# EAGLE design Acoustics (EAGLE 9.1.3)

## Sheet 1 of 5: Connectors
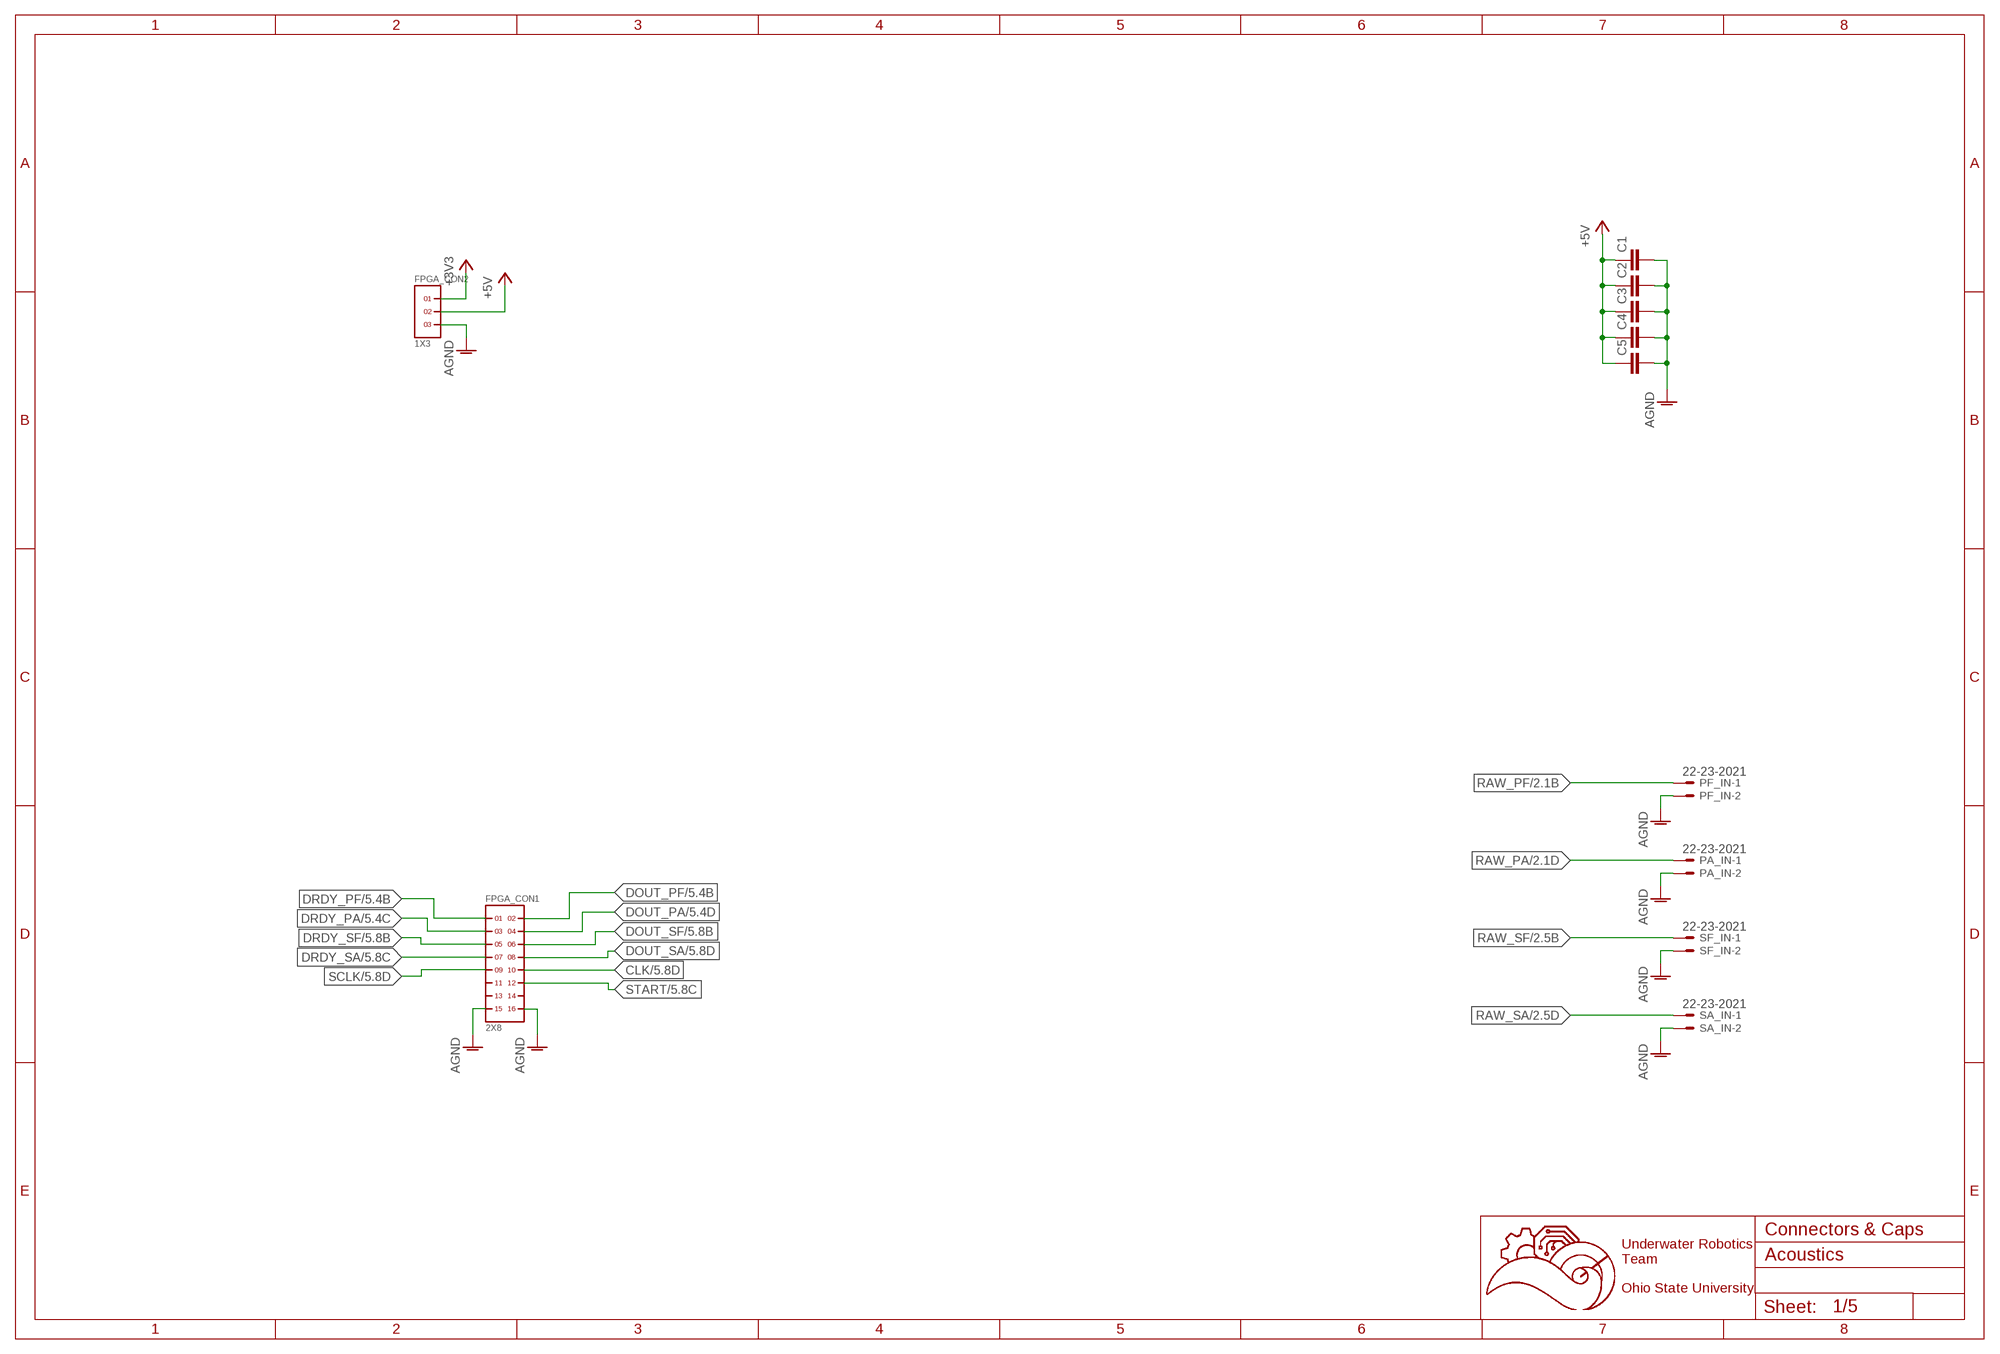
[diagram p0: schematic, sheet 1]

### Parts
C1  C2,5-3  [C2.5-3]
C2  C2,5-3  [C2.5-3]
C3  C2,5-3  [C2.5-3]
C4  C2,5-3  [C2.5-3]
C5  C2,5-3  [C2.5-3]
FPGA_CON1  2X8  [2X8]
FPGA_CON2  1X3  [1X3]
PA_IN  22-23-2021  [22-23-2021]
PF_IN  22-23-2021  [22-23-2021]
SA_IN  22-23-2021  [22-23-2021]
SF_IN  22-23-2021  [22-23-2021]

### Nets
+3V3: FPGA_CON2.1 ; also sheet 2,3,4,5
+5V: C1.1 C2.1 C3.1 C4.1 C5.1 FPGA_CON2.2
CLK: FPGA_CON1.10 ; also sheet 5
DOUT_PA: FPGA_CON1.4 ; also sheet 5
DOUT_PF: FPGA_CON1.2 ; also sheet 5
DOUT_SA: FPGA_CON1.8 ; also sheet 5
DOUT_SF: FPGA_CON1.6 ; also sheet 5
DRDY_PA: FPGA_CON1.3 ; also sheet 5
DRDY_PF: FPGA_CON1.1 ; also sheet 5
DRDY_SA: FPGA_CON1.7 ; also sheet 5
DRDY_SF: FPGA_CON1.5 ; also sheet 5
GND: C1.2 C2.2 C3.2 C4.2 C5.2 FPGA_CON1.15 FPGA_CON1.16 FPGA_CON2.3 PA_IN.2 PF_IN.2 SA_IN.2 SF_IN.2 ; supply symbol labelled AGND ; also sheet 2,3,4,5
RAW_PA: PA_IN.1 ; also sheet 2
RAW_PF: PF_IN.1 ; also sheet 2
RAW_SA: SA_IN.1 ; also sheet 2
RAW_SF: SF_IN.1 ; also sheet 2
SCLK: FPGA_CON1.9 ; also sheet 5
START: FPGA_CON1.12 ; also sheet 5
Unconnected: FPGA_CON1.11 FPGA_CON1.13 FPGA_CON1.14

### Notes on the sheet
- Connectors & Caps
- Underwater Robotics
  Team
  
  Ohio State University

## Sheet 2 of 5: Pre-amp
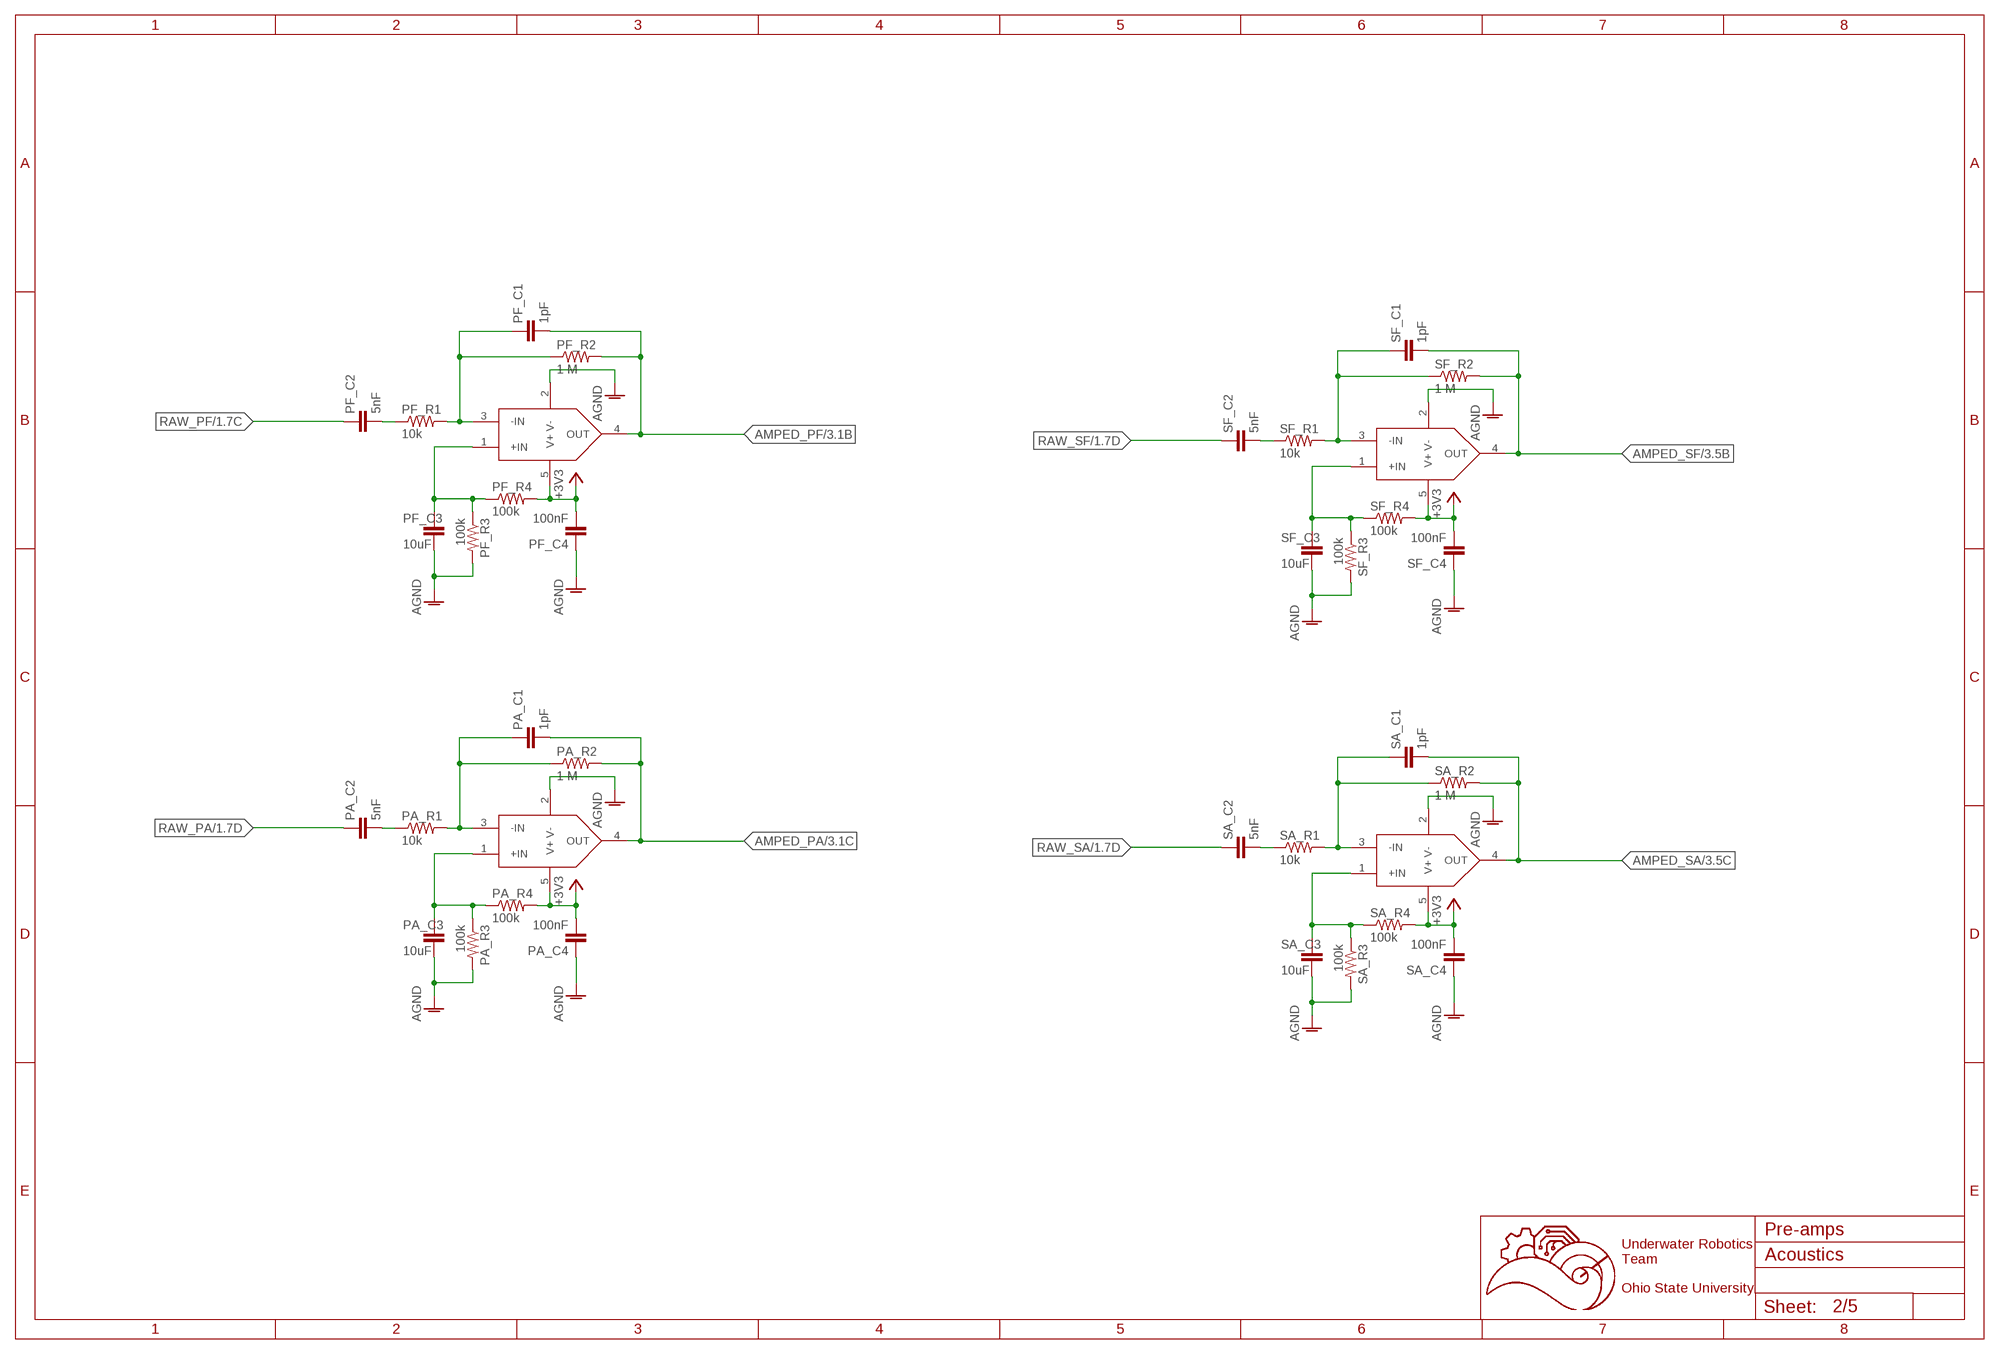
[diagram p1: schematic, sheet 2]

### Parts
H4_PREAMP4  TLV6741  [SC70-5]
PA_C1  1pF  C-EUC0603  [C0603]
PA_C2  5nF  C-EUC0603  [C0603]
PA_C3  10uF  C-EUC0603  [C0603]
PA_C4  100nF  C-EUC0603  [C0603]
PA_PREAMP  TLV6741  [SC70-5]
PA_R1  10k  R-US_R0603  [R0603]
PA_R2  1 M  R-US_R0603  [R0603]
PA_R3  100k  R-US_R0603  [R0603]
PA_R4  100k  R-US_R0603  [R0603]
PF_C1  1pF  C-EUC0603  [C0603]
PF_C2  5nF  C-EUC0603  [C0603]
PF_C3  10uF  C-EUC0603  [C0603]
PF_C4  100nF  C-EUC0603  [C0603]
PF_PREAMP  TLV6741  [SC70-5]
PF_R1  10k  R-US_R0603  [R0603]
PF_R2  1 M  R-US_R0603  [R0603]
PF_R3  100k  R-US_R0603  [R0603]
PF_R4  100k  R-US_R0603  [R0603]
SA_C1  1pF  C-EUC0603  [C0603]
SA_C2  5nF  C-EUC0603  [C0603]
SA_C3  10uF  C-EUC0603  [C0603]
SA_C4  100nF  C-EUC0603  [C0603]
SA_R1  10k  R-US_R0603  [R0603]
SA_R2  1 M  R-US_R0603  [R0603]
SA_R3  100k  R-US_R0603  [R0603]
SA_R4  100k  R-US_R0603  [R0603]
SF_C1  1pF  C-EUC0603  [C0603]
SF_C2  5nF  C-EUC0603  [C0603]
SF_C3  10uF  C-EUC0603  [C0603]
SF_C4  100nF  C-EUC0603  [C0603]
SF_PREAMP3  TLV6741  [SC70-5]
SF_R1  10k  R-US_R0603  [R0603]
SF_R2  1 M  R-US_R0603  [R0603]
SF_R3  100k  R-US_R0603  [R0603]
SF_R4  100k  R-US_R0603  [R0603]

### Nets
+3V3: H4_PREAMP4.5(V+) PA_C4.2 PA_PREAMP.5(V+) PA_R4.2 PF_C4.2 PF_PREAMP.5(V+) PF_R4.2 SA_C4.2 SA_R4.2 SF_C4.2 SF_PREAMP3.5(V+) SF_R4.2 ; also sheet 1,3,4,5
AMPED_PA: PA_C1.2 PA_PREAMP.4(OUT) PA_R2.2 ; also sheet 3
AMPED_PF: PF_C1.2 PF_PREAMP.4(OUT) PF_R2.2 ; also sheet 3
AMPED_SA: H4_PREAMP4.4(OUT) SA_C1.2 SA_R2.2 ; also sheet 3
AMPED_SF: SF_C1.2 SF_PREAMP3.4(OUT) SF_R2.2 ; also sheet 3
GND: H4_PREAMP4.2(V-) PA_C3.2 PA_C4.1 PA_PREAMP.2(V-) PA_R3.2 PF_C3.2 PF_C4.1 PF_PREAMP.2(V-) PF_R3.2 SA_C3.2 SA_C4.1 SA_R3.2 SF_C3.2 SF_C4.1 SF_PREAMP3.2(V-) SF_R3.2 ; supply symbol labelled AGND ; also sheet 1,3,4,5
N$133: PF_C2.2 PF_R1.1
N$134: PF_C1.1 PF_PREAMP.3(-IN) PF_R1.2 PF_R2.1
N$135: PF_C3.1 PF_PREAMP.1(+IN) PF_R3.1 PF_R4.1
N$137: PA_C2.2 PA_R1.1
N$138: PA_C1.1 PA_PREAMP.3(-IN) PA_R1.2 PA_R2.1
N$139: PA_C3.1 PA_PREAMP.1(+IN) PA_R3.1 PA_R4.1
N$141: SF_C2.2 SF_R1.1
N$142: SF_C1.1 SF_PREAMP3.3(-IN) SF_R1.2 SF_R2.1
N$143: SF_C3.1 SF_PREAMP3.1(+IN) SF_R3.1 SF_R4.1
N$145: SA_C2.2 SA_R1.1
N$146: H4_PREAMP4.3(-IN) SA_C1.1 SA_R1.2 SA_R2.1
N$147: H4_PREAMP4.1(+IN) SA_C3.1 SA_R3.1 SA_R4.1
RAW_PA: PA_C2.1 ; also sheet 1
RAW_PF: PF_C2.1 ; also sheet 1
RAW_SA: SA_C2.1 ; also sheet 1
RAW_SF: SF_C2.1 ; also sheet 1

### Notes on the sheet
- Pre-amps
- Underwater Robotics
  Team
  
  Ohio State University

## Sheet 3 of 5: Differential amplifier
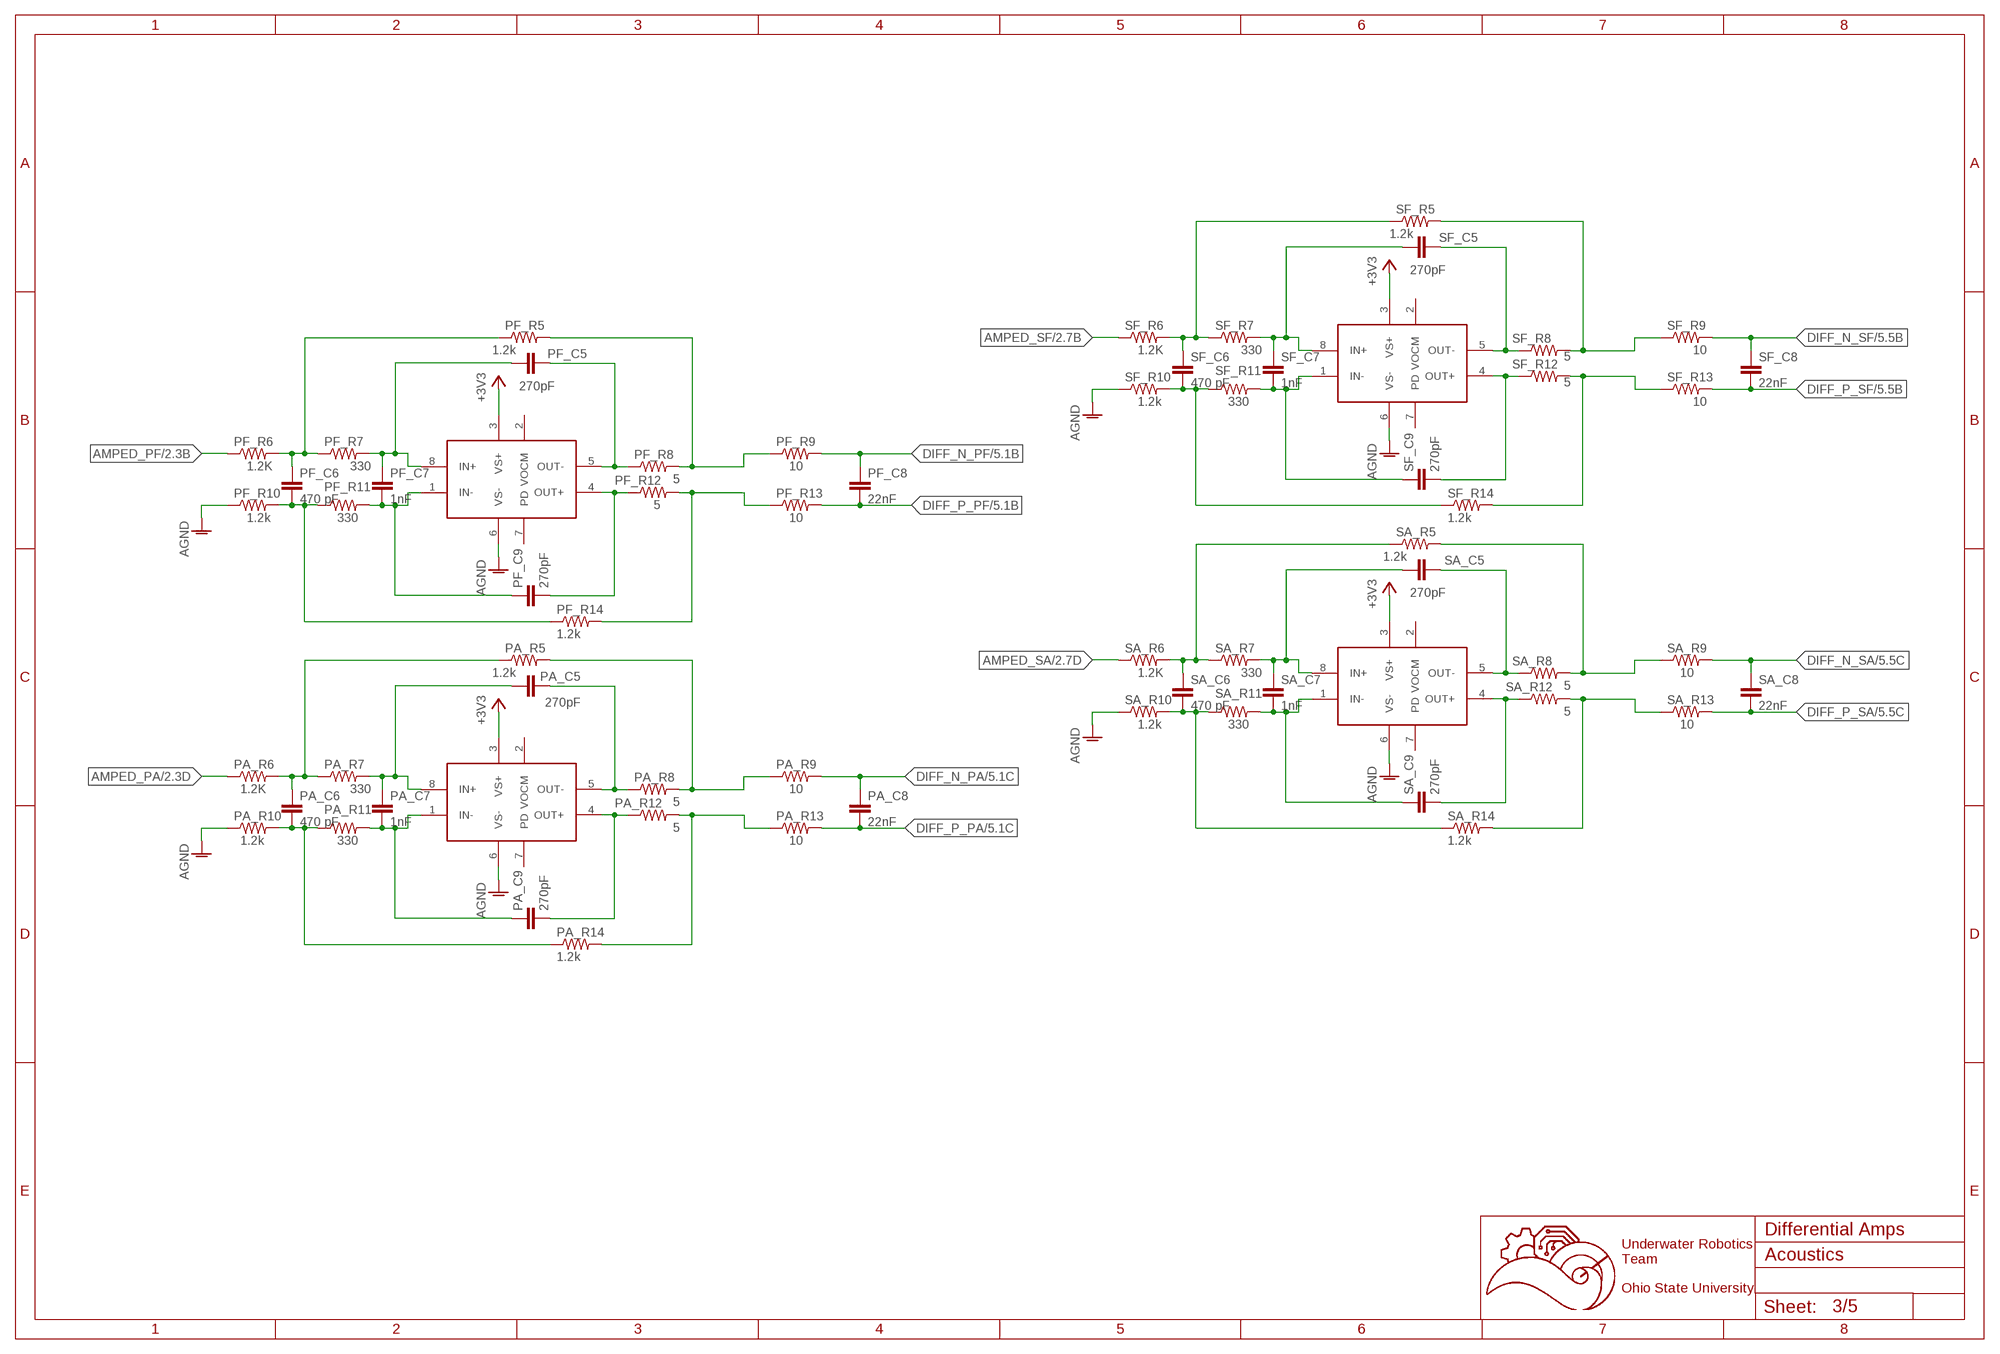
[diagram p2: schematic, sheet 3]

### Parts
PA_C5  270pF  C-EUC0603  [C0603]
PA_C6  470 pF  C-EUC0603  [C0603]
PA_C7  1nF  C-EUC0603  [C0603]
PA_C8  22nF  C-EUC0603  [C0603]
PA_C9  270pF  C-EUC0603  [C0603]
PA_DA  THS4551  [VSSOP-8]
PA_R5  1.2k  R-US_R0603  [R0603]
PA_R6  1.2K  R-US_R0603  [R0603]
PA_R7  330  R-US_R0603  [R0603]
PA_R8  5  R-US_R0603  [R0603]
PA_R9  10  R-US_R0603  [R0603]
PA_R10  1.2k  R-US_R0603  [R0603]
PA_R11  330  R-US_R0603  [R0603]
PA_R12  5  R-US_R0603  [R0603]
PA_R13  10  R-US_R0603  [R0603]
PA_R14  1.2k  R-US_R0603  [R0603]
PF_C5  270pF  C-EUC0603  [C0603]
PF_C6  470 pF  C-EUC0603  [C0603]
PF_C7  1nF  C-EUC0603  [C0603]
PF_C8  22nF  C-EUC0603  [C0603]
PF_C9  270pF  C-EUC0603  [C0603]
PF_DA  THS4551  [VSSOP-8]
PF_R5  1.2k  R-US_R0603  [R0603]
PF_R6  1.2K  R-US_R0603  [R0603]
PF_R7  330  R-US_R0603  [R0603]
PF_R8  5  R-US_R0603  [R0603]
PF_R9  10  R-US_R0603  [R0603]
PF_R10  1.2k  R-US_R0603  [R0603]
PF_R11  330  R-US_R0603  [R0603]
PF_R12  5  R-US_R0603  [R0603]
PF_R13  10  R-US_R0603  [R0603]
PF_R14  1.2k  R-US_R0603  [R0603]
SA_C5  270pF  C-EUC0603  [C0603]
SA_C6  470 pF  C-EUC0603  [C0603]
SA_C7  1nF  C-EUC0603  [C0603]
SA_C8  22nF  C-EUC0603  [C0603]
SA_C9  270pF  C-EUC0603  [C0603]
SA_DA  THS4551  [VSSOP-8]
SA_R5  1.2k  R-US_R0603  [R0603]
SA_R6  1.2K  R-US_R0603  [R0603]
SA_R7  330  R-US_R0603  [R0603]
SA_R8  5  R-US_R0603  [R0603]
SA_R9  10  R-US_R0603  [R0603]
SA_R10  1.2k  R-US_R0603  [R0603]
SA_R11  330  R-US_R0603  [R0603]
SA_R12  5  R-US_R0603  [R0603]
SA_R13  10  R-US_R0603  [R0603]
SA_R14  1.2k  R-US_R0603  [R0603]
SF_C5  270pF  C-EUC0603  [C0603]
SF_C6  470 pF  C-EUC0603  [C0603]
SF_C7  1nF  C-EUC0603  [C0603]
SF_C8  22nF  C-EUC0603  [C0603]
SF_C9  270pF  C-EUC0603  [C0603]
SF_DA  THS4551  [VSSOP-8]
SF_R5  1.2k  R-US_R0603  [R0603]
SF_R6  1.2K  R-US_R0603  [R0603]
SF_R7  330  R-US_R0603  [R0603]
SF_R8  5  R-US_R0603  [R0603]
SF_R9  10  R-US_R0603  [R0603]
SF_R10  1.2k  R-US_R0603  [R0603]
SF_R11  330  R-US_R0603  [R0603]
SF_R12  5  R-US_R0603  [R0603]
SF_R13  10  R-US_R0603  [R0603]
SF_R14  1.2k  R-US_R0603  [R0603]

### Nets
+3V3: PA_DA.3(VS+) PF_DA.3(VS+) SA_DA.3(VS+) SF_DA.3(VS+) ; also sheet 1,2,4,5
AMPED_PA: PA_R6.1 ; also sheet 2
AMPED_PF: PF_R6.1 ; also sheet 2
AMPED_SA: SA_R6.1 ; also sheet 2
AMPED_SF: SF_R6.1 ; also sheet 2
DIFF_N_PA: PA_C8.1 PA_R9.2 ; also sheet 5
DIFF_N_PF: PF_C8.1 PF_R9.2 ; also sheet 5
DIFF_N_SA: SA_C8.1 SA_R9.2 ; also sheet 5
DIFF_N_SF: SF_C8.1 SF_R9.2 ; also sheet 5
DIFF_P_PA: PA_C8.2 PA_R13.2 ; also sheet 5
DIFF_P_PF: PF_C8.2 PF_R13.2 ; also sheet 5
DIFF_P_SA: SA_C8.2 SA_R13.2 ; also sheet 5
DIFF_P_SF: SF_C8.2 SF_R13.2 ; also sheet 5
GND: PA_DA.6(VS-) PA_R10.1 PF_DA.6(VS-) PF_R10.1 SA_DA.6(VS-) SA_R10.1 SF_DA.6(VS-) SF_R10.1 ; supply symbol labelled AGND ; also sheet 1,2,4,5
N$1: PA_C5.2 PA_DA.5(OUT-) PA_R8.1
N$2: PA_C5.1 PA_C7.1 PA_DA.8(IN+) PA_R7.2
N$3: PA_C7.2 PA_C9.1 PA_DA.1(IN-) PA_R11.2
N$4: PA_C6.1 PA_R5.1 PA_R6.2 PA_R7.1
N$5: PA_C6.2 PA_R10.2 PA_R11.1 PA_R14.1
N$6: PA_C9.2 PA_DA.4(OUT+) PA_R12.1
N$7: PA_R5.2 PA_R8.2 PA_R9.1
N$8: PA_R12.2 PA_R13.1 PA_R14.2
N$9: SF_C5.2 SF_DA.5(OUT-) SF_R8.1
N$10: SF_C5.1 SF_C7.1 SF_DA.8(IN+) SF_R7.2
N$11: SF_C7.2 SF_C9.1 SF_DA.1(IN-) SF_R11.2
N$12: SF_C6.1 SF_R5.1 SF_R6.2 SF_R7.1
N$13: SF_C6.2 SF_R10.2 SF_R11.1 SF_R14.1
N$14: SF_C9.2 SF_DA.4(OUT+) SF_R12.1
N$15: SF_R5.2 SF_R8.2 SF_R9.1
N$16: SF_R12.2 SF_R13.1 SF_R14.2
N$17: SA_C5.2 SA_DA.5(OUT-) SA_R8.1
N$18: SA_C5.1 SA_C7.1 SA_DA.8(IN+) SA_R7.2
N$19: SA_C7.2 SA_C9.1 SA_DA.1(IN-) SA_R11.2
N$20: SA_C6.1 SA_R5.1 SA_R6.2 SA_R7.1
N$21: SA_C6.2 SA_R10.2 SA_R11.1 SA_R14.1
N$22: SA_C9.2 SA_DA.4(OUT+) SA_R12.1
N$23: SA_R5.2 SA_R8.2 SA_R9.1
N$24: SA_R12.2 SA_R13.1 SA_R14.2
N$88: PF_R12.2 PF_R13.1 PF_R14.2
N$97: PF_C5.2 PF_DA.5(OUT-) PF_R8.1
N$98: PF_C5.1 PF_C7.1 PF_DA.8(IN+) PF_R7.2
N$99: PF_C7.2 PF_C9.1 PF_DA.1(IN-) PF_R11.2
N$100: PF_C6.1 PF_R5.1 PF_R6.2 PF_R7.1
N$101: PF_C6.2 PF_R10.2 PF_R11.1 PF_R14.1
N$102: PF_C9.2 PF_DA.4(OUT+) PF_R12.1
N$109: PF_R5.2 PF_R8.2 PF_R9.1
Unconnected: PA_DA.2(VOCM) PA_DA.7(PD) PF_DA.2(VOCM) PF_DA.7(PD) SA_DA.2(VOCM) SA_DA.7(PD) SF_DA.2(VOCM) SF_DA.7(PD)

### Notes on the sheet
- Differential Amps
- Underwater Robotics
  Team
  
  Ohio State University

## Sheet 4 of 5: Voltage Reference
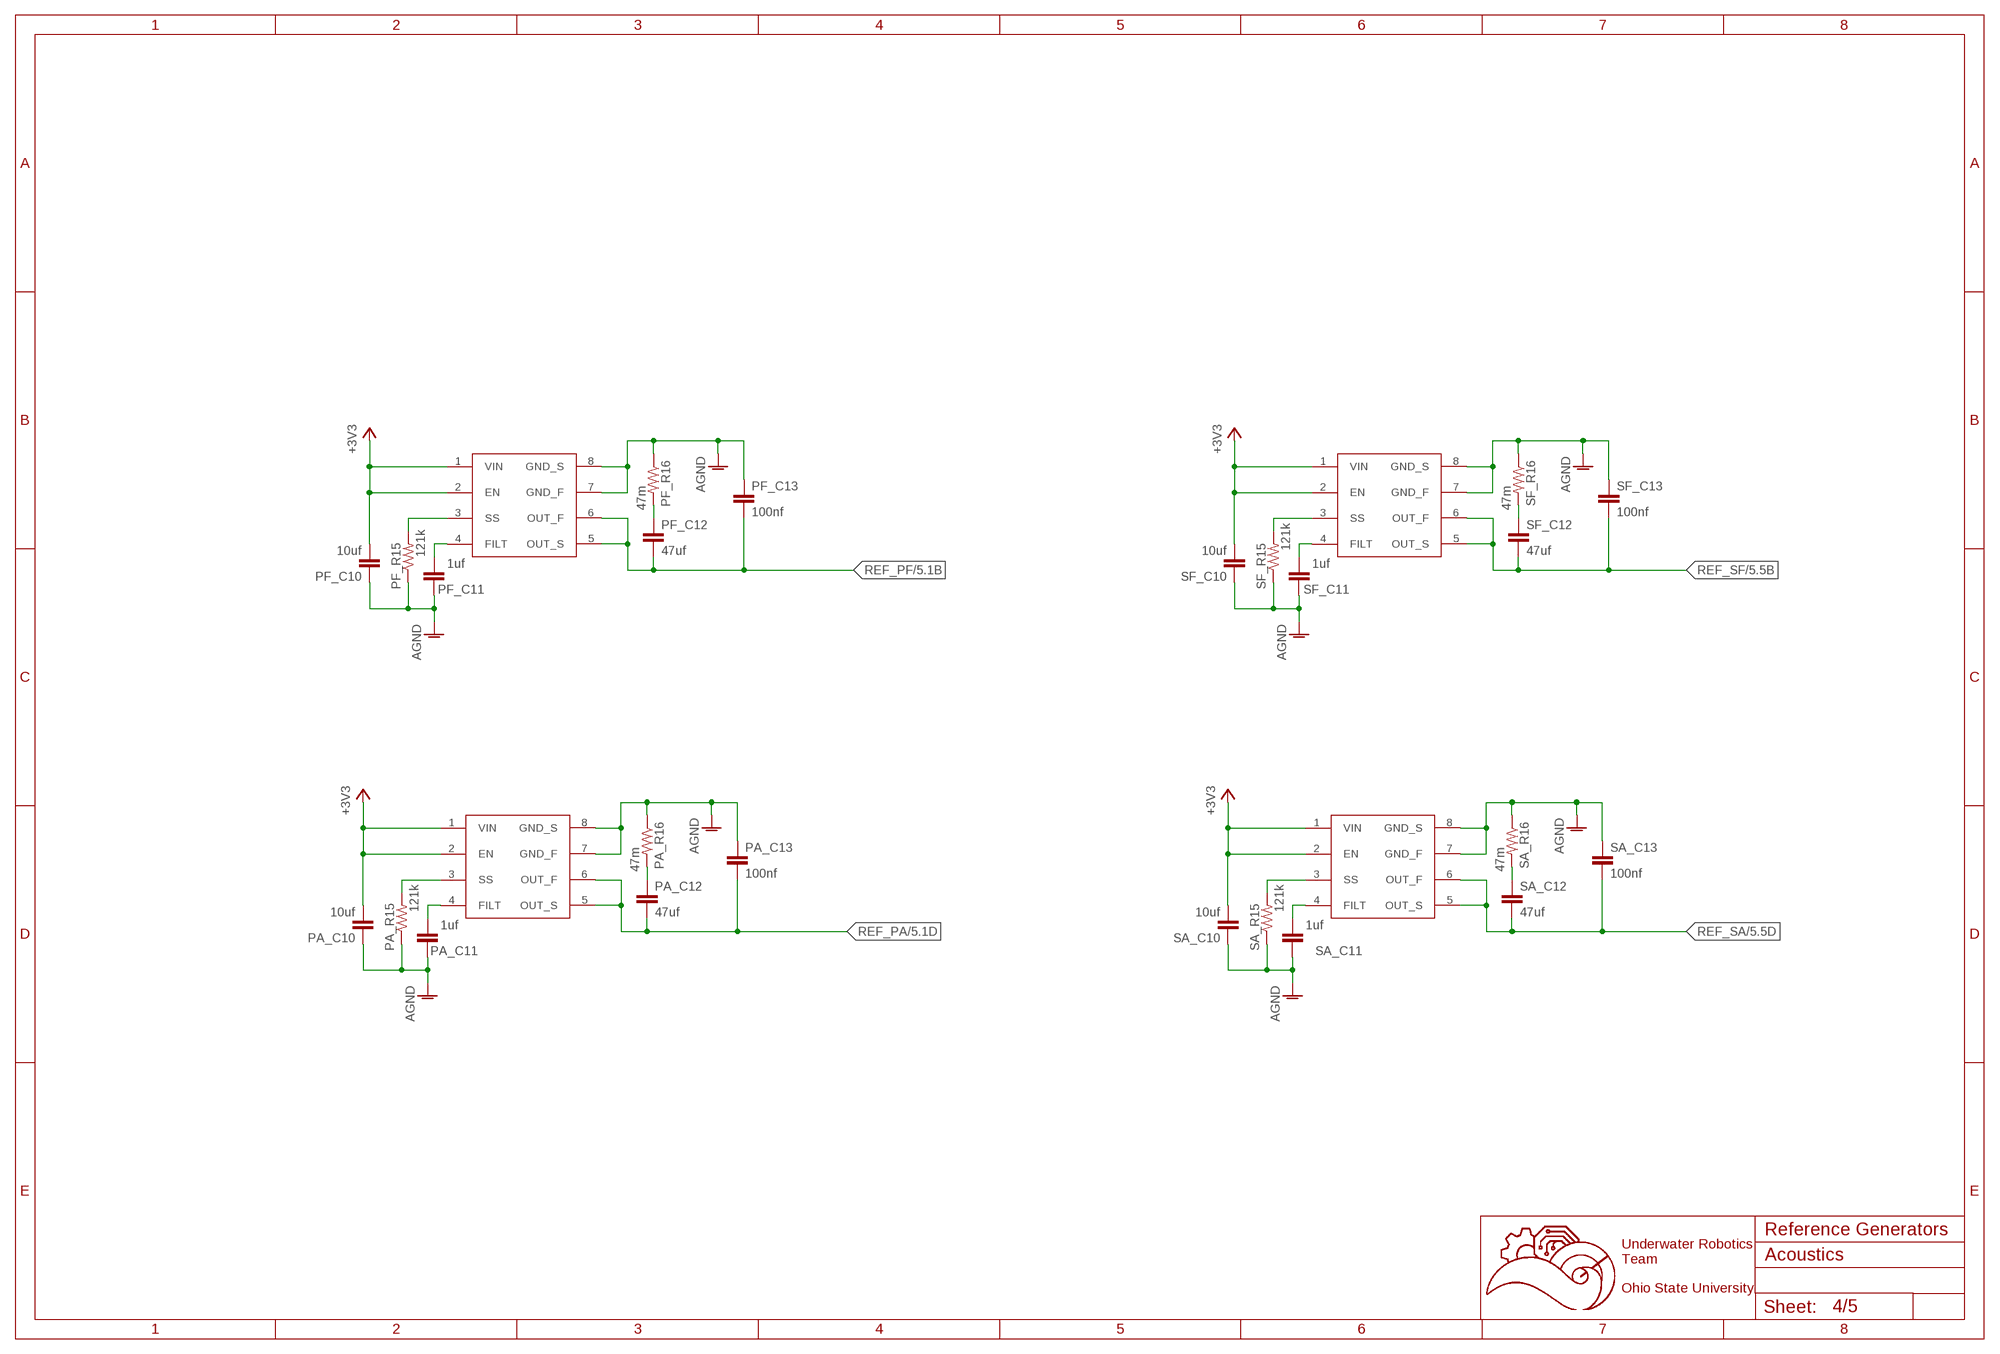
[diagram p3: schematic, sheet 4]

### Parts
PA_C10  10uf  C-EUC0603  [C0603]
PA_C11  1uf  C-EUC0603  [C0603]
PA_C12  47uf  C-EUC0603  [C0603]
PA_C13  100nf  C-EUC0603  [C0603]
PA_R15  121k  R-US_R0603  [R0603]
PA_R16  47m  R-US_R0603  [R0603]
PA_REFGEN  REF6025  [REF6025]
PF_C10  10uf  C-EUC0603  [C0603]
PF_C11  1uf  C-EUC0603  [C0603]
PF_C12  47uf  C-EUC0603  [C0603]
PF_C13  100nf  C-EUC0603  [C0603]
PF_R15  121k  R-US_R0603  [R0603]
PF_R16  47m  R-US_R0603  [R0603]
PF_REFGEN  REF6025  [REF6025]
SA_C10  10uf  C-EUC0603  [C0603]
SA_C11  1uf  C-EUC0603  [C0603]
SA_C12  47uf  C-EUC0603  [C0603]
SA_C13  100nf  C-EUC0603  [C0603]
SA_R15  121k  R-US_R0603  [R0603]
SA_R16  47m  R-US_R0603  [R0603]
SA_REFGEN  REF6025  [REF6025]
SF_C10  10uf  C-EUC0603  [C0603]
SF_C11  1uf  C-EUC0603  [C0603]
SF_C12  47uf  C-EUC0603  [C0603]
SF_C13  100nf  C-EUC0603  [C0603]
SF_R15  121k  R-US_R0603  [R0603]
SF_R16  47m  R-US_R0603  [R0603]
SF_REFGEN  REF6025  [REF6025]

### Nets
+3V3: PA_C10.2 PA_REFGEN.1(VIN) PA_REFGEN.2(EN) PF_C10.2 PF_REFGEN.1(VIN) PF_REFGEN.2(EN) SA_C10.2 SA_REFGEN.1(VIN) SA_REFGEN.2(EN) SF_C10.2 SF_REFGEN.1(VIN) SF_REFGEN.2(EN) ; also sheet 1,2,3,5
GND: PA_C10.1 PA_C11.1 PA_C13.1 PA_R15.1 PA_R16.1 PA_REFGEN.7(GND_F) PA_REFGEN.8(GND_S) PF_C10.1 PF_C11.1 PF_C13.1 PF_R15.1 PF_R16.1 PF_REFGEN.7(GND_F) PF_REFGEN.8(GND_S) SA_C10.1 SA_C11.1 SA_C13.1 SA_R15.1 SA_R16.1 SA_REFGEN.7(GND_F) SA_REFGEN.8(GND_S) SF_C10.1 SF_C11.1 SF_C13.1 SF_R15.1 SF_R16.1 SF_REFGEN.7(GND_F) SF_REFGEN.8(GND_S) ; supply symbol labelled AGND ; also sheet 1,2,3,5
N$103: PF_C11.2 PF_REFGEN.4(FILT)
N$104: PF_R15.2 PF_REFGEN.3(SS)
N$105: PF_C12.1 PF_R16.2
N$110: PA_C11.2 PA_REFGEN.4(FILT)
N$116: PA_R15.2 PA_REFGEN.3(SS)
N$117: PA_C12.1 PA_R16.2
N$118: SF_C11.2 SF_REFGEN.4(FILT)
N$121: SF_R15.2 SF_REFGEN.3(SS)
N$124: SF_C12.1 SF_R16.2
N$129: SA_C11.2 SA_REFGEN.4(FILT)
N$130: SA_R15.2 SA_REFGEN.3(SS)
N$131: SA_C12.1 SA_R16.2
REF_PA: PA_C12.2 PA_C13.2 PA_REFGEN.5(OUT_S) PA_REFGEN.6(OUT_F) ; also sheet 5
REF_PF: PF_C12.2 PF_C13.2 PF_REFGEN.5(OUT_S) PF_REFGEN.6(OUT_F) ; also sheet 5
REF_SA: SA_C12.2 SA_C13.2 SA_REFGEN.5(OUT_S) SA_REFGEN.6(OUT_F) ; also sheet 5
REF_SF: SF_C12.2 SF_C13.2 SF_REFGEN.5(OUT_S) SF_REFGEN.6(OUT_F) ; also sheet 5

### Notes on the sheet
- Reference Generators
- Underwater Robotics
  Team
  
  Ohio State University

## Sheet 5 of 5: ADCs
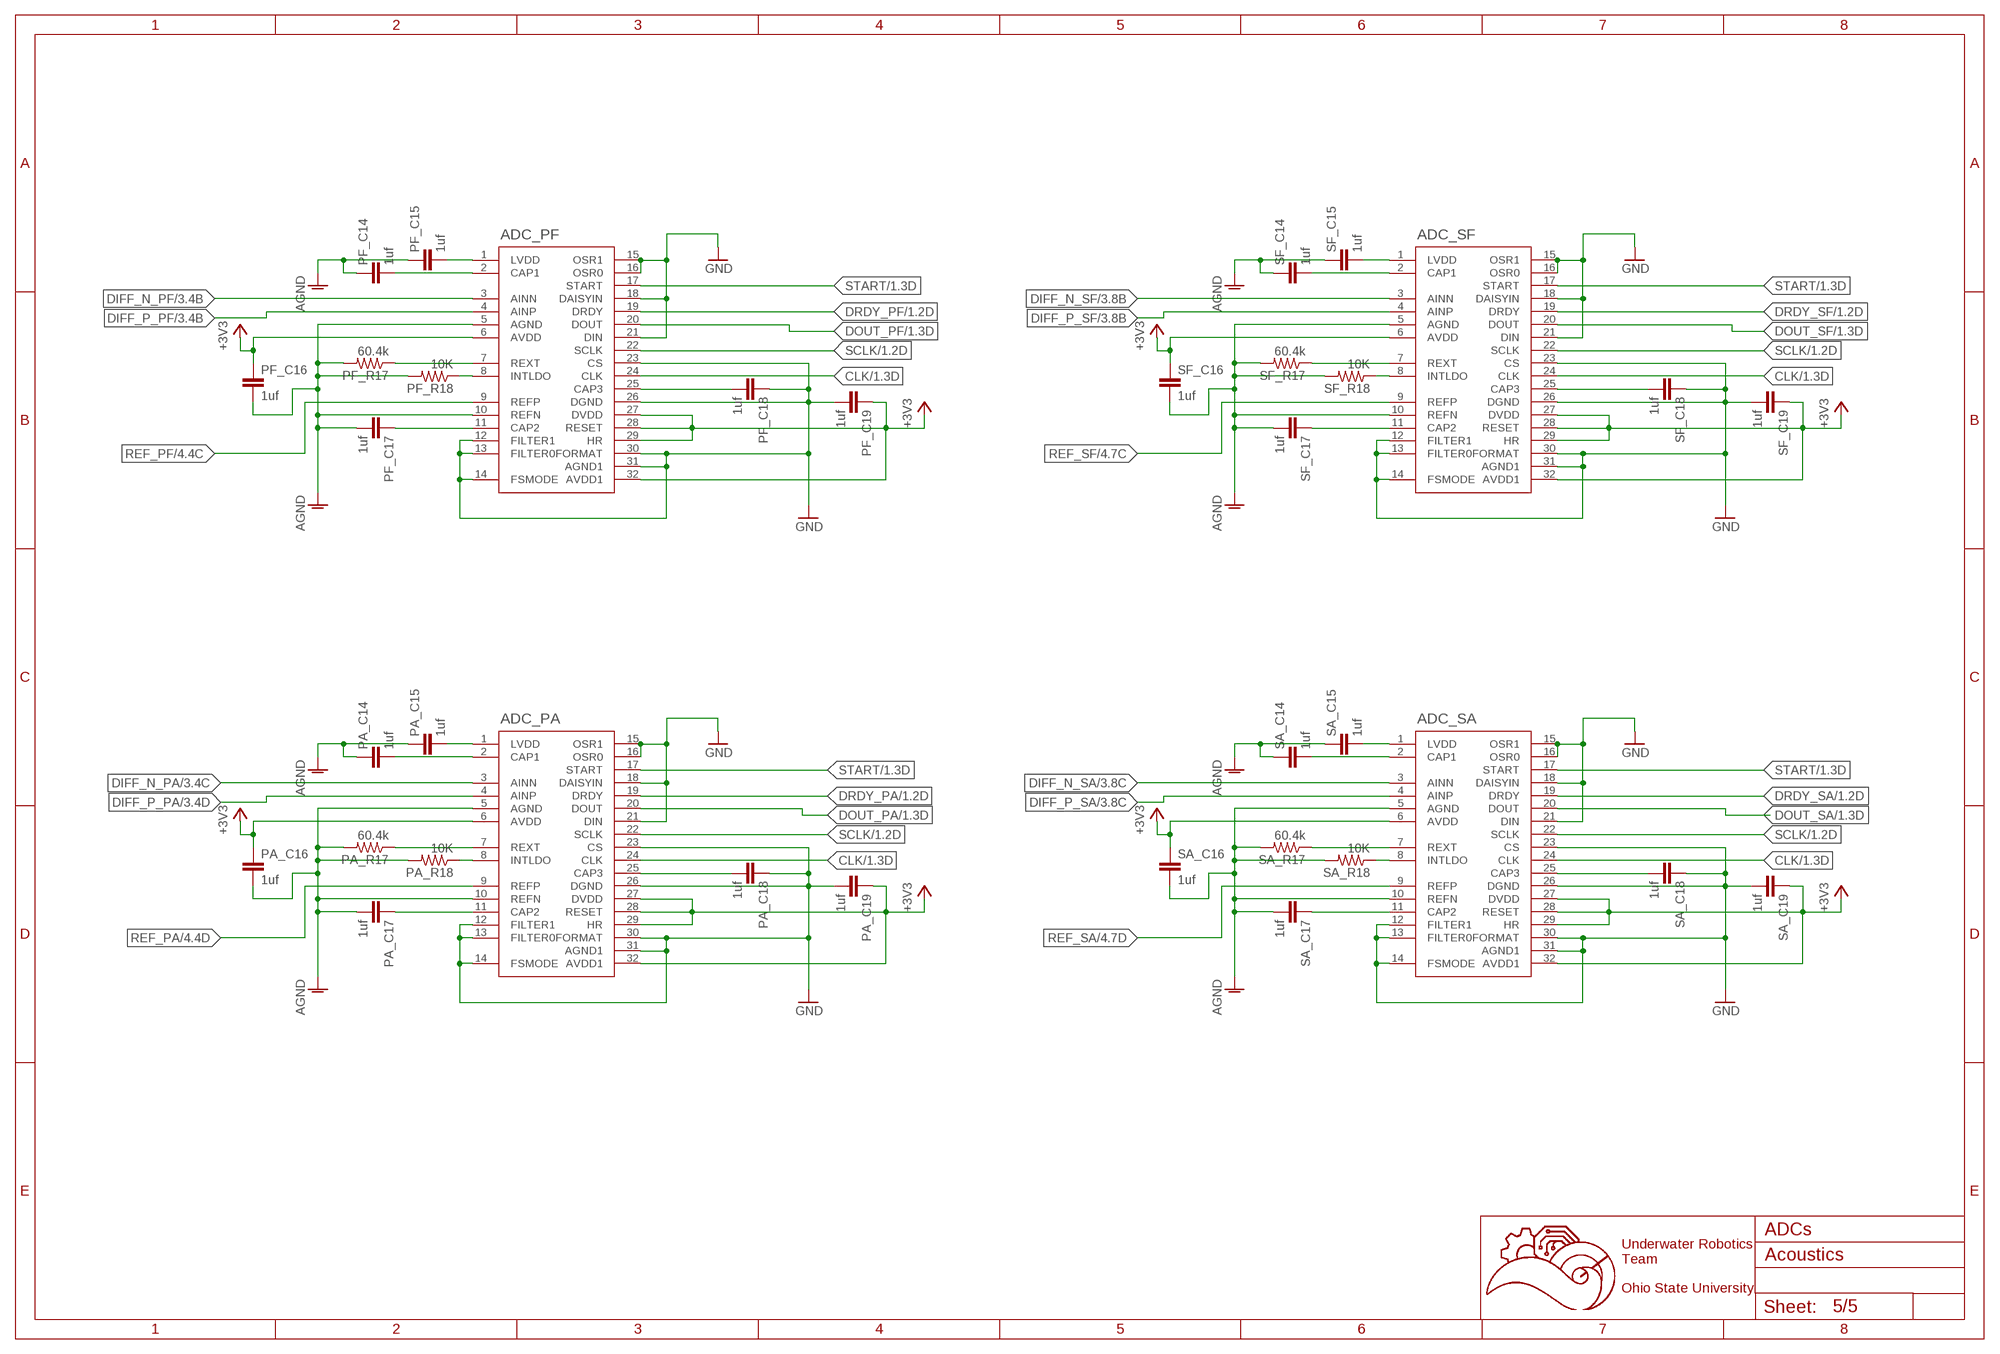
[diagram p4: schematic, sheet 5]

### Parts
ADC_PA  ADS124S08IPBSRPBS0032A_L  [PBS0032A_L]
ADC_PF  ADS124S08IPBSRPBS0032A_L  [PBS0032A_L]
ADC_SA  ADS124S08IPBSRPBS0032A_L  [PBS0032A_L]
ADC_SF  ADS124S08IPBSRPBS0032A_L  [PBS0032A_L]
PA_C14  1uf  C-EUC0603  [C0603]
PA_C15  1uf  C-EUC0603  [C0603]
PA_C16  1uf  C-EUC0603K  [C0603K]
PA_C17  1uf  C-EUC0603  [C0603]
PA_C18  1uf  C-EUC0603  [C0603]
PA_C19  1uf  C-EUC0603  [C0603]
PA_R17  60.4k  R-US_R0603  [R0603]
PA_R18  10K  R-US_R0603  [R0603]
PF_C14  1uf  C-EUC0603  [C0603]
PF_C15  1uf  C-EUC0603  [C0603]
PF_C16  1uf  C-EUC0603K  [C0603K]
PF_C17  1uf  C-EUC0603  [C0603]
PF_C18  1uf  C-EUC0603  [C0603]
PF_C19  1uf  C-EUC0603  [C0603]
PF_R17  60.4k  R-US_R0603  [R0603]
PF_R18  10K  R-US_R0603  [R0603]
SA_C14  1uf  C-EUC0603  [C0603]
SA_C15  1uf  C-EUC0603  [C0603]
SA_C16  1uf  C-EUC0603K  [C0603K]
SA_C17  1uf  C-EUC0603  [C0603]
SA_C18  1uf  C-EUC0603  [C0603]
SA_C19  1uf  C-EUC0603  [C0603]
SA_R17  60.4k  R-US_R0603  [R0603]
SA_R18  10K  R-US_R0603  [R0603]
SF_C14  1uf  C-EUC0603  [C0603]
SF_C15  1uf  C-EUC0603  [C0603]
SF_C16  1uf  C-EUC0603K  [C0603K]
SF_C17  1uf  C-EUC0603  [C0603]
SF_C18  1uf  C-EUC0603  [C0603]
SF_C19  1uf  C-EUC0603  [C0603]
SF_R17  60.4k  R-US_R0603  [R0603]
SF_R18  10K  R-US_R0603  [R0603]

### Nets
+3V3: ADC_PA.6(AVDD) ADC_PA.27(DVDD) ADC_PA.28(RESET) ADC_PA.29(HR) ADC_PA.32(AVDD1) ADC_PF.6(AVDD) ADC_PF.27(DVDD) ADC_PF.28(RESET) ADC_PF.29(HR) ADC_PF.32(AVDD1) ADC_SA.6(AVDD) ADC_SA.27(DVDD) ADC_SA.28(RESET) ADC_SA.29(HR) ADC_SA.32(AVDD1) ADC_SF.6(AVDD) ADC_SF.27(DVDD) ADC_SF.28(RESET) ADC_SF.29(HR) ADC_SF.32(AVDD1) PA_C16.1 PA_C19.1 PF_C16.1 PF_C19.1 SA_C16.1 SA_C19.1 SF_C16.1 SF_C19.1 ; also sheet 1,2,3,4
CLK: ADC_PA.24(CLK) ADC_PF.24(CLK) ADC_SA.24(CLK) ADC_SF.24(CLK) ; also sheet 1
DIFF_N_PA: ADC_PA.3(AINN) ; also sheet 3
DIFF_N_PF: ADC_PF.3(AINN) ; also sheet 3
DIFF_N_SA: ADC_SA.3(AINN) ; also sheet 3
DIFF_N_SF: ADC_SF.3(AINN) ; also sheet 3
DIFF_P_PA: ADC_PA.4(AINP) ; also sheet 3
DIFF_P_PF: ADC_PF.4(AINP) ; also sheet 3
DIFF_P_SA: ADC_SA.4(AINP) ; also sheet 3
DIFF_P_SF: ADC_SF.4(AINP) ; also sheet 3
DOUT_PA: ADC_PA.20(DOUT) ; also sheet 1
DOUT_PF: ADC_PF.20(DOUT) ; also sheet 1
DOUT_SA: ADC_SA.20(DOUT) ; also sheet 1
DOUT_SF: ADC_SF.20(DOUT) ; also sheet 1
DRDY_PA: ADC_PA.19(DRDY) ; also sheet 1
DRDY_PF: ADC_PF.19(DRDY) ; also sheet 1
DRDY_SA: ADC_SA.19(DRDY) ; also sheet 1
DRDY_SF: ADC_SF.19(DRDY) ; also sheet 1
GND: ADC_PA.5(AGND) ADC_PA.10(REFN) ADC_PA.12(FILTER1) ADC_PA.13(FILTER0) ADC_PA.14(FSMODE) ADC_PA.15(OSR1) ADC_PA.16(OSR0) ADC_PA.18(DAISYIN) ADC_PA.21(DIN) ADC_PA.23(CS) ADC_PA.26(DGND) ADC_PA.30(FORMAT) ADC_PA.31(AGND1) ADC_PF.5(AGND) ADC_PF.10(REFN) ADC_PF.12(FILTER1) ADC_PF.13(FILTER0) ADC_PF.14(FSMODE) ADC_PF.15(OSR1) ADC_PF.16(OSR0) ADC_PF.18(DAISYIN) ADC_PF.21(DIN) ADC_PF.23(CS) ADC_PF.26(DGND) ADC_PF.30(FORMAT) ADC_PF.31(AGND1) ADC_SA.5(AGND) ADC_SA.10(REFN) ADC_SA.12(FILTER1) ADC_SA.13(FILTER0) ADC_SA.14(FSMODE) ADC_SA.15(OSR1) ADC_SA.16(OSR0) ADC_SA.18(DAISYIN) ADC_SA.21(DIN) ADC_SA.23(CS) ADC_SA.26(DGND) ADC_SA.30(FORMAT) ADC_SA.31(AGND1) ADC_SF.5(AGND) ADC_SF.10(REFN) ADC_SF.12(FILTER1) ADC_SF.13(FILTER0) ADC_SF.14(FSMODE) ADC_SF.15(OSR1) ADC_SF.16(OSR0) ADC_SF.18(DAISYIN) ADC_SF.21(DIN) ADC_SF.23(CS) ADC_SF.26(DGND) ADC_SF.30(FORMAT) ADC_SF.31(AGND1) PA_C14.1 PA_C15.1 PA_C16.2 PA_C17.2 PA_C18.1 PA_C19.2 PA_R17.2 PA_R18.2 PF_C14.1 PF_C15.1 PF_C16.2 PF_C17.2 PF_C18.1 PF_C19.2 PF_R17.2 PF_R18.2 SA_C14.1 SA_C15.1 SA_C16.2 SA_C17.2 SA_C18.1 SA_C19.2 SA_R17.2 SA_R18.2 SF_C14.1 SF_C15.1 SF_C16.2 SF_C17.2 SF_C18.1 SF_C19.2 SF_R17.2 SF_R18.2 ; supply symbol labelled AGND ; also sheet 1,2,3,4
N$132: ADC_PF.2(CAP1) PF_C14.2
N$136: ADC_PA.1(LVDD) PA_C15.2
N$140: ADC_PA.8(INTLDO) PA_R18.1
N$144: ADC_PA.7(REXT) PA_R17.1
N$148: ADC_PA.11(CAP2) PA_C17.1
N$149: ADC_PA.25(CAP3) PA_C18.2
N$150: ADC_PF.1(LVDD) PF_C15.2
N$151: ADC_PA.2(CAP1) PA_C14.2
N$152: ADC_PF.8(INTLDO) PF_R18.1
N$153: ADC_PF.7(REXT) PF_R17.1
N$154: ADC_PF.11(CAP2) PF_C17.1
N$155: ADC_PF.25(CAP3) PF_C18.2
N$156: ADC_SF.1(LVDD) SF_C15.2
N$157: ADC_SF.8(INTLDO) SF_R18.1
N$158: ADC_SF.7(REXT) SF_R17.1
N$159: ADC_SF.11(CAP2) SF_C17.1
N$160: ADC_SF.25(CAP3) SF_C18.2
N$161: ADC_SF.2(CAP1) SF_C14.2
N$162: ADC_SA.1(LVDD) SA_C15.2
N$163: ADC_SA.8(INTLDO) SA_R18.1
N$164: ADC_SA.7(REXT) SA_R17.1
N$165: ADC_SA.11(CAP2) SA_C17.1
N$166: ADC_SA.25(CAP3) SA_C18.2
N$167: ADC_SA.2(CAP1) SA_C14.2
REF_PA: ADC_PA.9(REFP) ; also sheet 4
REF_PF: ADC_PF.9(REFP) ; also sheet 4
REF_SA: ADC_SA.9(REFP) ; also sheet 4
REF_SF: ADC_SF.9(REFP) ; also sheet 4
SCLK: ADC_PA.22(SCLK) ADC_PF.22(SCLK) ADC_SA.22(SCLK) ADC_SF.22(SCLK) ; also sheet 1
START: ADC_PA.17(START) ADC_PF.17(START) ADC_SA.17(START) ADC_SF.17(START) ; also sheet 1

### Notes on the sheet
- ADCs
- Underwater Robotics
  Team
  
  Ohio State University

## Library data of the parts
ADC_PA ADC_PF ADC_SA ADC_SF = ADS127L01_ADC:ADS124S08IPBSR
C1-C5 = capacitor-wima:C: CAPACITOR naming: grid - package width
FPGA_CON1 = headers(2mm):2X8
FPGA_CON2 = headers(2mm):1X3
H4_PREAMP4 PA_PREAMP PF_PREAMP SF_PREAMP3 = lio:TLV6741
PA_C1-PA_C9 PF_C1-PF_C9 SA_C1-SA_C9 SF_C1-SF_C9 = resistor:C-EU: CAPACITOR, European symbol
PA_C10-PA_C19 PF_C10-PF_C19 SA_C10-SA_C19 SF_C10-SF_C19 = rcl:C-EU: CAPACITOR, European symbol
PA_DA PF_DA SA_DA SF_DA = THS4551:THS4551
PA_IN PF_IN SA_IN SF_IN = con-molex:22-23-2021: .100" (2.54mm) Center Header - 2 Pin; MF: MOLEX; MPN: 22-23-2021; OC_FARNELL: 1462926; OC_NEWARK: 25C3832
PA_R1-PA_R16 PF_R1-PF_R16 SA_R1-SA_R16 SF_R1-SF_R16 = resistor:R-US_: RESISTOR, American symbol
PA_R17 PA_R18 PF_R17 PF_R18 SA_R17 SA_R18 SF_R17 SF_R18 = rcl:R-US_: RESISTOR, American symbol
PA_REFGEN PF_REFGEN SA_REFGEN SF_REFGEN = REF6025:REF6025

## Board
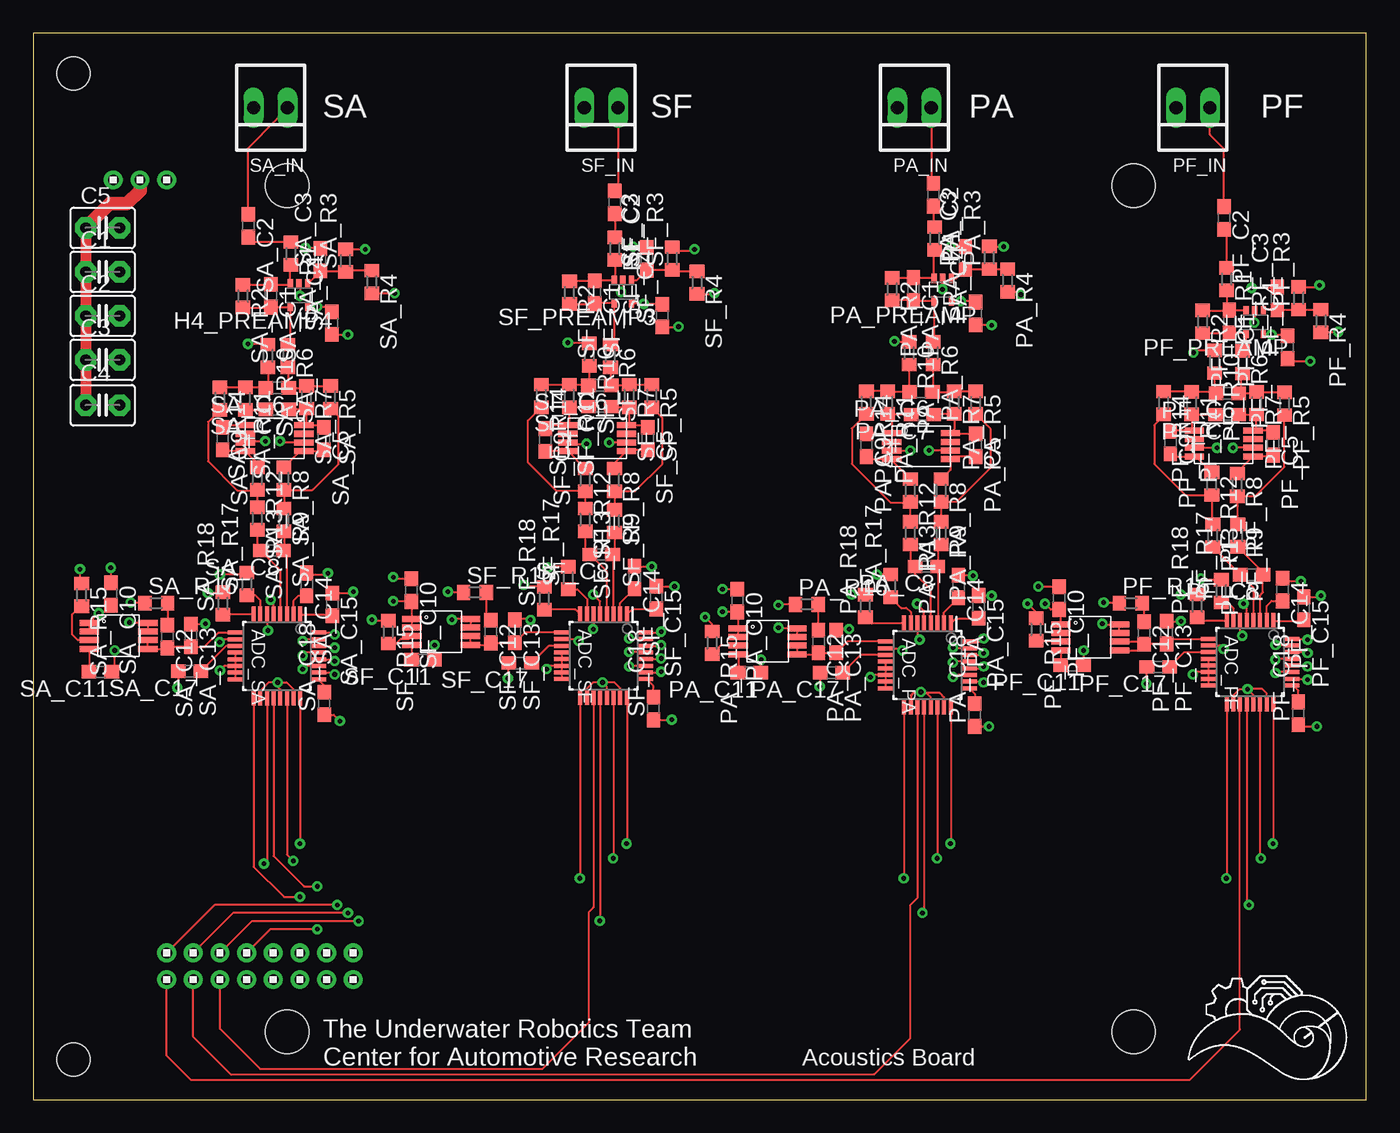
[diagram p5: board, top side]
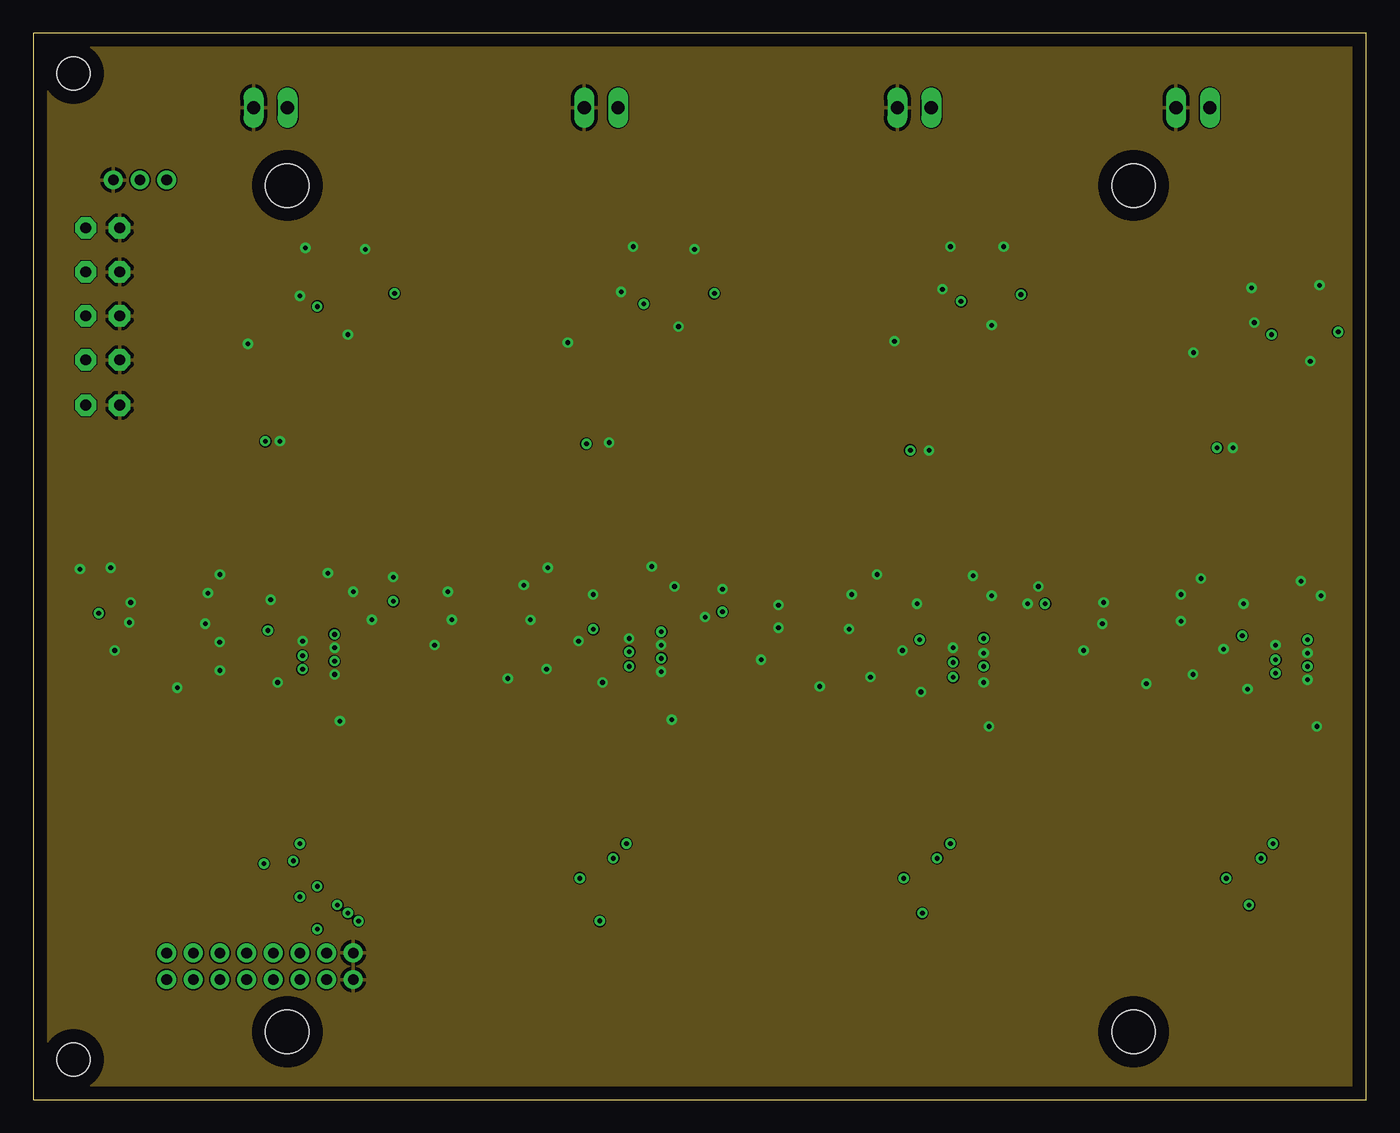
[diagram p6: board, inner layer GND]
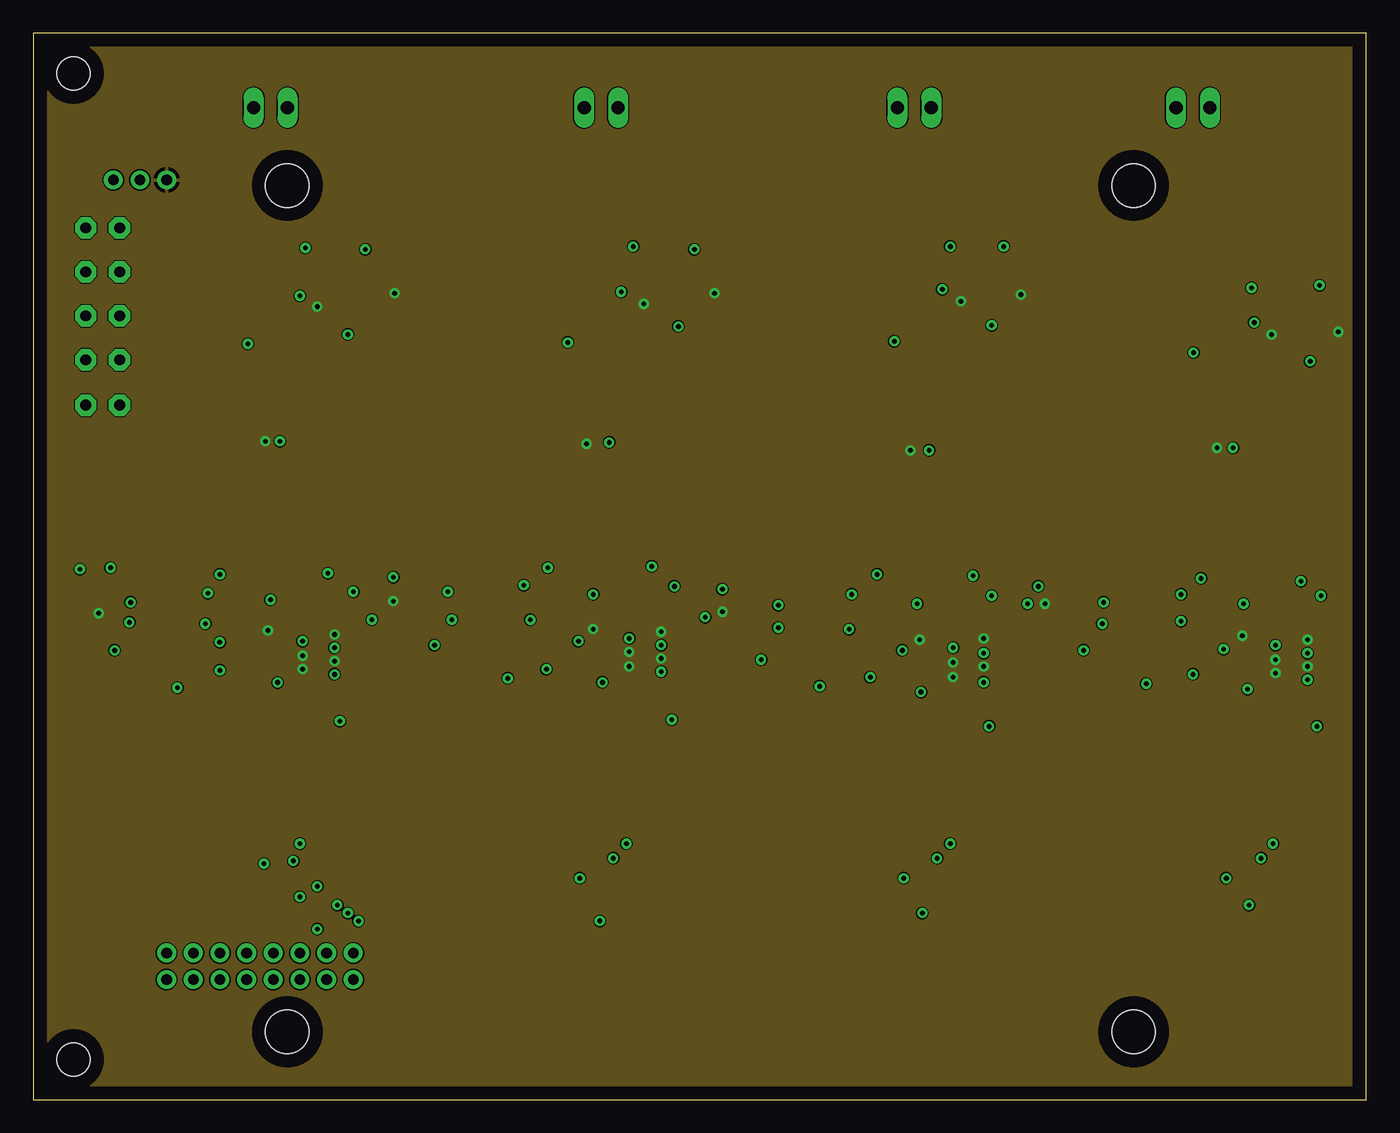
[diagram p7: board, inner layer +3v3]
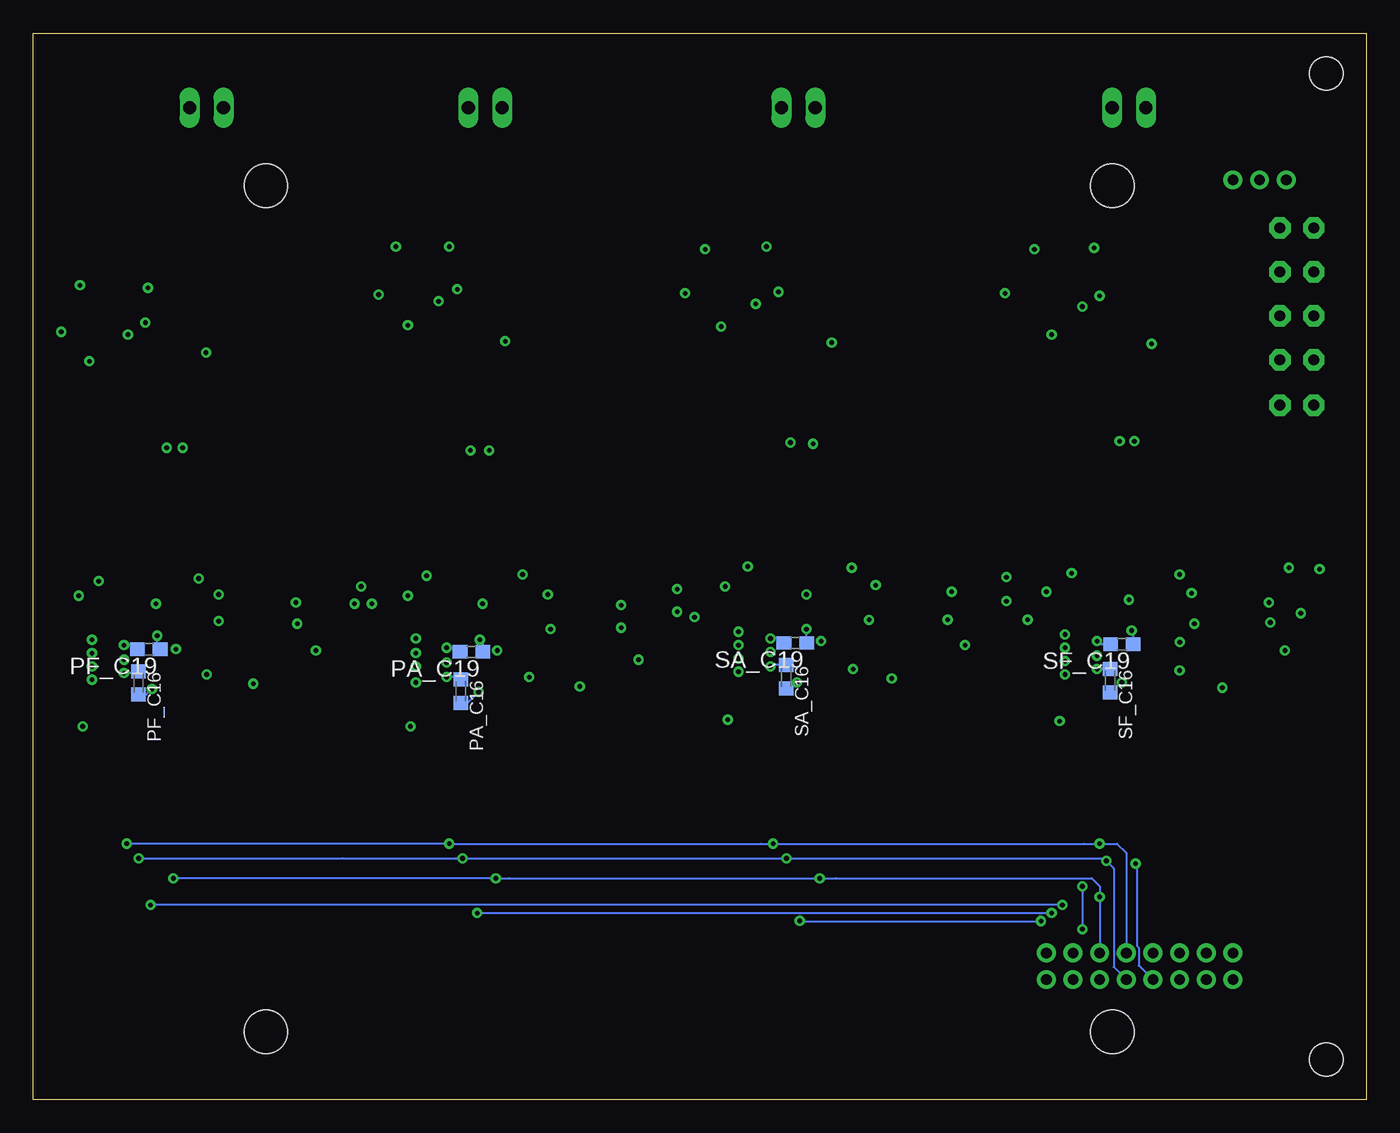
[diagram p8: board, bottom side, seen from below]

Size 100 x 80 mm. Coordinates in mm from the lower left corner, seen from the top.
Outline: 0,0 100,0 100,80 0,80 0,0
Copper layers (1+2*15+16): Top 0.035mm / dielectric 1.5mm / GND 0.017mm / dielectric 0.15mm / +3v3 0.017mm / dielectric 0.2mm / Bottom 0.035mm
Design rules "default *": minimum track width 3.5mil, minimum drill 0.2mm, track to track 3.5mil, track to pad 3.5mil, pad to pad 3.5mil, via to via 3.5mil, smd to smd 0mil, copper to edge 40mil, drill to drill 6mil, minimum pad ring 10mil, minimum via ring 8mil, stop-mask expansion 4mil, vias tented up to drill 0mil, thermal gap 10mil
Holes 2.5 mm at 3,77 3,3
Holes 3.26 mm at 19.05,68.58 82.55,68.58 82.55,5.08 19.05,5.08

### Footprints (pad centres in the part's own frame; a part is rotated, then mirrored left to right if it is on the bottom)
PBS0032A_L = smd 1.2 x 0.3: 1 -3.1,1.75; 2 -3.1,1.25; 3 -3.1,0.75; 4 -3.1,0.25; 5 -3.1,-0.25; 6 -3.1,-0.75; 7 -3.1,-1.25; 8 -3.1,-1.75; 17 3.1,-1.75; 18 3.1,-1.25; 19 3.1,-0.75; 20 3.1,-0.25; 21 3.1,0.25; 22 3.1,0.75; 23 3.1,1.25; 24 3.1,1.75 | smd 0.3 x 1.2: 9 -1.75,-3.1; 10 -1.25,-3.1; 11 -0.75,-3.1; 12 -0.25,-3.1; 13 0.25,-3.1; 14 0.75,-3.1; 15 1.25,-3.1; 16 1.75,-3.1; 25 1.75,3.1; 26 1.25,3.1; 27 0.75,3.1; 28 0.25,3.1; 29 -0.25,3.1; 30 -0.75,3.1; 31 -1.25,3.1; 32 -1.75,3.1
C2.5-3 = drill 0.813 pad 1.6 octagon: 1 -1.27,0; 2 1.27,0
2X8 = drill 0.8 pad 1.422: 1 -7,-1; 2 -7,1; 3 -5,-1; 4 -5,1; 5 -3,-1; 6 -3,1; 7 -1,-1; 8 -1,1; 9 1,-1; 10 1,1; 11 3,-1; 12 3,1; 13 5,-1; 14 5,1; 15 7,-1; 16 7,1
1X3 = drill 0.8 pad 1.422: 1 -2,0; 2 0,0; 3 2,0
SC70-5 = smd 0.4 x 0.7: 1 -0.65,-0.85; 2 0,-0.85; 3 0.65,-0.85; 4 0.65,0.85; 5 -0.65,0.85
C0603 = smd 1.1 x 1: 1 -0.85,0; 2 0.85,0
C0603K = smd 1.05 x 1.08: 1 -0.875,0; 2 0.875,0
VSSOP-8 = smd 0.45 x 1.45: 1 0,0; 2 0.65,0; 3 1.3,0; 4 1.95,0; 5 1.95,4.4; 6 1.3,4.4; 7 0.65,4.4; 8 0,4.4
22-23-2021 = drill 1 long: 1 -1.27,0; 2 1.27,0
R0603 = smd 1 x 1.1: 1 -0.85,0; 2 0.85,0
REF6025 = smd 0.45 x 1.45: 1 -0.975,-2.2; 2 -0.325,-2.2; 3 0.325,-2.2; 4 0.975,-2.2; 5 0.975,2.2; 6 0.325,2.2; 7 -0.325,2.2; 8 -0.975,2.2

### Placement (x,y rotation side)
ADC_PA  67.08,32.61 270 top
ADC_PF  91.28,32.83 270 top
ADC_SA  18.28,33.28 270 top
ADC_SF  42.78,33.3 270 top
C1  5.2,62.1 0 top
C2  5.2,58.8 0 top
C3  5.2,55.5 0 top
C4  5.2,52.1 0 top
C5  5.2,65.4 0 top
FPGA_CON1  17,10 0 top
FPGA_CON2  8,69 180 top
H4_PREAMP4  19.93,60.34 180 top
PA_C1  66.03,60.82 270 top
PA_C2  67.53,67.88 270 top
PA_C3  69.93,63.15 90 top
PA_C4  70.69,58.98 90 top
PA_C5  70.7,49.1 270 top
PA_C6  66.6,53.1 180 top
PA_C7  66.7,51.4 180 top
PA_C8  67,40 180 top
PA_C9  62.5,49.1 270 top
PA_C10  52.82,37.44 270 top
PA_C11  53.71,32.03 180 top
PA_C12  58.91,34.37 270 top
PA_C13  60.23,34.37 270 top
PA_C14  69.41,38.49 270 top
PA_C15  70.93,36.97 270 top
PA_C16  67.91,30.64 270 bottom
PA_C17  59.89,32.03 180 top
PA_C18  70.63,28.85 90 top
PA_C19  67.13,33.59 180 bottom
PA_DA  64.4,50 270 top
PA_IN  66.1,74.42 180 top
PA_PREAMP  68.23,60.76 180 top
PA_R1  67.63,64.6 270 top
PA_R2  64.43,60.8 270 top
PA_R3  71.73,63.16 90 top
PA_R4  73.09,61.46 270 top
PA_R5  70.7,52.3 270 top
PA_R6  67.5,56 270 top
PA_R7  69.1,52.3 270 top
PA_R8  68.1,45.7 270 top
PA_R9  68.1,42.5 270 top
PA_R10  65.7,56 270 top
PA_R11  64.1,52.3 270 top
PA_R12  65.8,45.7 270 top
PA_R13  65.8,42.5 270 top
PA_R14  62.5,52.3 270 top
PA_R15  50.93,34.27 270 top
PA_R16  58.03,37.15 0 top
PA_R17  64.31,38.55 90 top
PA_R18  62.43,37.03 90 top
PA_REFGEN  55.09,34.39 270 top
PF_C1  89.73,58.38 270 top
PF_C2  89.33,66.14 270 top
PF_C3  93.33,60.1 90 top
PF_C4  94.09,56.44 90 top
PF_C5  93.02,49.2 270 top
PF_C6  89.58,53 180 top
PF_C7  89.57,51.4 180 top
PF_C8  91.41,39.38 180 top
PF_C9  85.31,49.29 270 top
PF_C10  76.96,37.62 270 top
PF_C11  77.93,32.59 180 top
PF_C12  83.33,35.01 270 top
PF_C13  85.03,35.03 270 top
PF_C14  93.73,38.26 270 top
PF_C15  95.31,36.86 270 top
PF_C16  92.1,31.26 270 bottom
PF_C17  84.4,32.46 180 top
PF_C18  94.91,28.98 90 top
PF_C19  91.33,33.78 180 bottom
PF_DA  87.1,50.2 270 top
PF_IN  87,74.42 180 top
PF_PREAMP  91.63,58.32 180 top
PF_R1  89.53,61.56 270 top
PF_R2  87.73,58.36 270 top
PF_R3  94.93,60.12 90 top
PF_R4  96.59,58.42 270 top
PF_R5  93.87,52.21 270 top
PF_R6  90.73,55.32 270 top
PF_R7  91.78,52.24 270 top
PF_R8  90.33,46.12 270 top
PF_R9  90.36,42.33 270 top
PF_R10  88.63,55.36 270 top
PF_R11  86.91,52.26 270 top
PF_R12  88.42,46.2 270 top
PF_R13  88.49,42.3 270 top
PF_R14  84.79,52.27 270 top
PF_R15  75.23,35.26 270 top
PF_R16  82.33,37.24 0 top
PF_R17  89.13,38.14 90 top
PF_R18  87.31,37.04 90 top
PF_REFGEN  79.29,34.68 270 top
SA_C1  17.83,60.3 270 top
SA_C2  16.13,65.56 270 top
SA_C3  21.53,63.02 90 top
SA_C4  22.39,58.26 90 top
SA_C5  21.8,49.6 270 top
SA_C6  18.3,53.4 180 top
SA_C7  18.3,51.8 180 top
SA_C8  17.9,41.2 180 top
SA_C9  14.2,49.6 270 top
SA_C10  5.83,37.94 270 top
SA_C11  5.03,32.09 180 top
SA_C12  10.06,34.73 270 top
SA_C13  11.83,34.81 270 top
SA_C14  20.51,38.66 270 top
SA_C15  22.43,37.14 270 top
SA_C16  43.51,31.71 270 bottom
SA_C17  11.72,32.14 180 top
SA_C18  21.83,29.72 90 top
SA_C19  42.83,34.26 180 bottom
SA_DA  15.9,50.6 270 top
SA_IN  17.8,74.42 180 top
SA_R1  19.33,63.48 270 top
SA_R2  15.73,60.28 270 top
SA_R3  23.43,62.94 90 top
SA_R4  25.39,61.34 270 top
SA_R5  22.3,52.7 270 top
SA_R6  19.1,55.8 270 top
SA_R7  20.5,52.7 270 top
SA_R8  18.8,46.6 270 top
SA_R9  18.8,43.5 270 top
SA_R10  17.6,55.8 270 top
SA_R11  15.9,52.6 270 top
SA_R12  16.8,46.6 270 top
SA_R13  16.8,43.6 270 top
SA_R14  14,52.6 270 top
SA_R15  3.63,37.87 270 top
SA_R16  9.23,37.25 0 top
SA_R17  16.03,38.7 90 top
SA_R18  14.22,37.22 90 top
SA_REFGEN  6.39,34.79 270 top
SF_C1  42.13,60.56 270 top
SF_C2  43.63,67.32 270 top
SF_C3  46.03,63.09 90 top
SF_C4  47.19,58.82 90 top
SF_C5  46.1,49.6 270 top
SF_C6  42.5,53.6 180 top
SF_C7  42.5,52 180 top
SF_C8  42.6,40.9 180 top
SF_C9  38.4,49.5 270 top
SF_C10  28.36,38.22 270 top
SF_C11  29.23,32.99 180 top
SF_C12  34.33,35.11 270 top
SF_C13  36.13,35.13 270 top
SF_C14  45.11,39.17 270 top
SF_C15  46.73,37.65 270 top
SF_C16  19.21,31.43 270 bottom
SF_C17  36.52,32.75 180 top
SF_C18  46.53,29.33 90 top
SF_C19  18.33,34.17 180 bottom
SF_DA  40.1,50.6 270 top
SF_IN  42.6,74.42 180 top
SF_PREAMP3  44.23,60.6 180 top
SF_R1  43.63,63.84 270 top
SF_R2  40.23,60.54 270 top
SF_R3  47.93,63.1 90 top
SF_R4  49.8,61.3 270 top
SF_R5  46.4,52.8 270 top
SF_R6  43.3,55.8 270 top
SF_R7  44.7,52.8 270 top
SF_R8  43.6,46.5 270 top
SF_R9  43.6,43.4 270 top
SF_R10  41.7,55.9 270 top
SF_R11  40.2,52.8 270 top
SF_R12  41.4,46.5 270 top
SF_R13  41.4,43.5 270 top
SF_R14  38.1,52.8 270 top
SF_R15  26.63,35.07 270 top
SF_R16  33.13,38.05 0 top
SF_R17  40.12,39.13 90 top
SF_R18  38.33,37.61 90 top
SF_REFGEN  30.59,35.09 270 top

### Tracks (layer width: path | path; a pad name or v marks a point on that pad's centre or on a via)
+3V3  (via drill 0.35)
  Top 0.152: PF_DA.3 v88.8,48.9 | PA_PREAMP.5 69.59,59.91 | 69.59,59.91 v69.6,59.9 | PA_C4.2 70.61,59.91 69.59,59.91 | PA_DA.3 v65.8,48.7 | v51.7,36.6 52.81,36.6 PA_C10.2 52.89,36.52 PA_REFGEN.1 PA_REFGEN.2 | SF_REFGEN.2 SF_REFGEN.1 28.36,36.09 SF_C10.2 27.03,37.37 v27,37.4 | SA_REFGEN.2 SA_REFGEN.1 v4.91,36.49 5.23,36.49 SA_C10.2 | PF_PREAMP.5 92.31,57.4 v92.9,57.4 93.98,57.4 PF_C4.2 | SF_R4.2 51.05,60.45 51.2,60.3 51.2,60.4 v51.1,60.5 | SF_PREAMP3.5 45.65,59.75 45.7,59.7 v45.8,59.7 45.83,59.67 SF_C4.2 | SF_DA.3 40.2,49.2 v41.5,49.2 | SA_R4.2 26.79,60.49 26.8,60.5 v27.1,60.5 | H4_PREAMP4.5 21.19,59.49 21.2,59.5 v21.3,59.5 22,59.5 SA_C4.2 | SA_DA.3 16,49.4 v17.4,49.4 | PF_R4.2 97.87,57.57 v97.9,57.6 | PA_R4.2 73.89,60.61 v74.1,60.4 | ADC_SF.32 47.05,35.05 v47.1,35.1 | ADC_SF.28 47.05,33.05 v47.1,33.1 | ADC_SF.29 45.83,33.59 v44.7,33.59 | ADC_SF.27 44.74,32.55 v44.7,32.5 | ADC_SF.6 42.03,35.33 v42,35.3 | ADC_PA.6 66.33,34.67 v66.5,34.5 | ADC_PA.32 71.06,34.36 v71.3,34.6 | ADC_PA.28 71.16,32.36 v71.3,32.5 | ADC_PA.29 69.06,32.86 v69,32.8 | ADC_PA.27 69.16,31.86 v69,31.7 | ADC_PF.32 95.53,34.58 v95.6,34.5 | ADC_PF.28 95.53,32.58 v95.6,32.5 | ADC_PF.27 93.28,32.08 v93.2,32 | ADC_PF.29 93.27,33.08 v93.2,33 | ADC_PF.6 90.53,34.97 v90.7,34.8 | ADC_SA.6 17.53,35.27 v17.6,35.2 | ADC_SA.32 22.47,35.03 v22.6,34.9 | ADC_SA.28 22.47,33.03 v22.6,32.9 | ADC_SA.27 20.43,32.53 v20.2,32.3 | ADC_SA.29 20.43,33.53 v20.2,33.3 | PF_REFGEN.2 PF_REFGEN.1 77.09,36.64 PF_C10.2 76.33,36.77 v75.9,37.2
  Bottom 0.152: SA_C19.1 41.98,35.28 v42,35.3 | SA_C16.1 44.61,32.59 v44.7,32.5 | v66.5,34.5 66.28,34.28 PA_C19.1 | PA_C16.1 68.09,31.7 v69,31.7 | PF_C19.1 90.7,34.01 v90.7,34.8 | PF_C16.1 92.23,32 v93.2,32 | SF_C19.1 17.48,35.08 v17.6,35.2 | SF_C16.1 v20.2,32.3
  pour +3v3: 0,80 100,80 100,0 0,0
+5V
  Top 0.813: C5.1 C1.1 C2.1 C3.1 C4.1
  Top 1.016: C5.1 5.73,67.2 7,67.2 8,68.2 FPGA_CON2.2
AMPED_PA
  Top 0.152: PA_R2.2 64.45,59.97 PA_C1.2 66.09,59.91 PA_PREAMP.4 67.58,56.93 PA_R6.1
AMPED_PF
  Top 0.152: PF_R2.2 89.71,57.51 PF_C1.2 90.92,57.53 PF_PREAMP.4 90.98,56.42 PF_R6.1
AMPED_SA
  Top 0.152: SA_R2.2 17.81,59.43 SA_C1.2 19.24,59.45 H4_PREAMP4.4 19.28,56.83 SA_R6.1
AMPED_SF
  Top 0.152: SF_R2.2 42.11,59.69 SF_C1.2 42.17,59.75 SF_PREAMP3.4 43.58,57.8 43.58,56.93 SF_R6.1
CLK  (via drill 0.35)
  Top 0.152: ADC_SF.24 44.53,19.23 v44.5,19.2 | ADC_PA.24 68.83,19.23 v68.8,19.2 | ADC_PF.24 93.03,19.23 v93,19.2 | ADC_SA.24 20.03,19.23 v20,19.2
  Bottom 0.152: FPGA_CON1.10 18,18.5 18.7,19.2 v20,19.2 21.2,19.2 v44.5,19.2 45.4,19.2 v68.8,19.2 v93,19.2
DIFF_N_PA
  Top 0.152: PA_R9.2 67.85,41.4 PA_C8.1 67.85,35.73 ADC_PA.3
DIFF_N_PF
  Top 0.152: ADC_PF.3 92,35.95 92,37.8 92.26,38.06 PF_C8.1 92.26,39.58 PF_R9.2
DIFF_N_SA
  Top 0.152: SA_R9.2 18.8,41.25 SA_C8.1 19.03,40.92 ADC_SA.3
DIFF_N_SF
  Top 0.152: SF_R9.2 43.6,41.05 43.52,40.98 | 43.52,40.98 SF_C8.1 | ADC_SF.3 43.53,40.97 43.52,40.98
DIFF_P_PA
  Top 0.152: PA_R13.2 65.8,40.35 PA_C8.2 66.15,39.45 67.33,38.27 ADC_PA.4
DIFF_P_PF
  Top 0.152: PF_R13.2 90.39,39.55 90.39,39.54 PF_C8.2 91.53,38.4 ADC_PF.4
DIFF_P_SA
  Top 0.152: SA_R13.2 16.8,41.45 SA_C8.2 18.53,39.72 ADC_SA.4
DIFF_P_SF
  Top 0.152: SF_R13.2 41.4,41.25 SF_C8.2 43.03,39.62 ADC_SF.4
DOUT_PA  (via drill 0.35)
  Top 0.152: v23.6,13.99 14.99,13.99 FPGA_CON1.4 | ADC_PA.20 66.83,14.12 v66.7,13.99
  Bottom 0.152: v66.7,13.99 v23.6,13.99
DOUT_PF  (via drill 0.35)
  Top 0.152: v22.8,14.6 13.6,14.6 FPGA_CON1.2 | ADC_PF.20 91.03,14.77 v91.2,14.6
  Bottom 0.152: v22.8,14.6 v91.2,14.6
DOUT_SA  (via drill 0.35)
  Top 0.152: v21.3,12.78 17.78,12.78 FPGA_CON1.8 | ADC_SA.20 18.03,18.27 20.31,15.99 v21.3,15.99
  Bottom 0.152: v21.3,15.99 v21.3,12.78
DOUT_SF  (via drill 0.35)
  Top 0.152: v24.4,13.39 16.39,13.39 FPGA_CON1.6 | ADC_SF.20 42.53,13.43 v42.5,13.4
  Bottom 0.152: v42.5,13.4 42.49,13.39 v24.4,13.39
DRDY_PA
  Top 0.152: FPGA_CON1.3 12,4.7 14.8,1.9 63.1,1.9 65.8,4.6 65.8,14.6 66.33,15.13 ADC_PA.19
DRDY_PF
  Top 0.152: FPGA_CON1.1 10,3.3 11.8,1.5 86.78,1.5 90.53,5.25 ADC_PF.19
DRDY_SA  (via drill 0.35)
  Top 0.152: ADC_SA.19 17.53,17.93 v17.3,17.7
  Bottom 0.152: FPGA_CON1.7 17.06,10.06 17.06,11.39 17.2,11.53 17.2,17.6 v17.3,17.7
DRDY_SF
  Top 0.152: FPGA_CON1.5 14,5.3 17,2.3 38.2,2.3 41.7,5.8 41.7,14.1 42.03,14.43 ADC_SF.19
GND  (via drill 0.35)
  Top 0.152: PF_DA.6 v90,48.9 | PF_R10.1 87.3,56.21 87.09,56 v87.04,56.04 | PA_C4.1 71.87,58.13 v71.9,58.1 | PA_DA.6 v67.2,48.7 | PA_C18.1 v71.7,28 | PA_REFGEN.7 PA_REFGEN.8 55.94,35.36 v55.9,35.4 | PA_C10.1 51.71,38.29 v51.7,38.3 | PA_C11.1 54.56,32.96 v54.6,33 | PA_R16.1 55.95,37.15 v55.9,37.1 | PA_C15.1 71.88,37.82 v71.9,37.8 | PA_C14.1 70.46,39.34 v70.5,39.3 | PA_R17.2 v63.3,39.4 | PA_R18.2 61.42,37.88 v61.4,37.9 | PA_C17.2 59.04,31.04 v59,31 | PA_C13.1 60.31,35.3 v61.2,35.3 | PA_R10.1 64.65,56.85 v64.6,56.9 | PA_PREAMP.2 68.2,61.58 v68.2,60.8 | PA_R3.2 v72.79,64.01 v72.8,64 | PA_C3.2 v68.81,63.99 v68.8,64 | SF_REFGEN.7 SF_REFGEN.8 31.44,36.06 31.4,36.1 v31.4,36 | SA_REFGEN.7 SA_REFGEN.8 7.47,35.77 7.4,35.7 7.3,35.8 v7.2,35.8 | SA_C18.1 22.53,28.87 v23,28.4 | PF_PREAMP.2 91.65,58.35 v91.6,58.3 | PF_C3.2 93.27,60.9 v91.4,60.9 | PF_R3.2 96.37,60.97 v96.5,61.1 | PF_C4.1 94.28,55.4 v95.8,55.4 | PF_R17.2 87.51,38.99 87.5,39 v87.6,39.1 | PF_C14.1 93.94,38.9 v95.1,38.9 | PF_C15.1 95.33,37.7 96.5,37.7 v96.6,37.8 | PF_C18.1 95.05,28 v96.3,28 | PF_R18.2 v86.11,37.89 v86.1,37.9 | PF_C13.1 86.08,35.88 v86.1,35.9 | PF_C17.2 83.5,32.41 v83.5,31.2 | PF_R16.1 80.34,37.24 80.3,37.2 v80.3,37.3 | PF_C11.1 78.8,32.61 v78.8,33.7 | PF_C10.1 75.47,38.47 75.4,38.4 v75.4,38.5 | SF_C3.2 44.87,63.94 44.8,64 v45,64 | SF_R3.2 48.18,63.7 49.6,63.7 v49.6,63.8 | SF_C4.1 48.43,57.97 48.5,57.9 v48.4,58 | SF_R10.1 40.15,56.75 v40.1,56.8 | SF_DA.6 v43.2,49.3 | SF_R17.2 38.62,39.98 38.6,40 v38.6,39.9 | SF_R18.2 38.29,38.5 36.9,38.5 v36.8,38.6 | SF_C14.1 45.14,40 v46.4,40 | SF_C15.1 v48.1,38.5 | SF_C18.1 47.78,28.48 47.8,28.5 v47.9,28.5 | ADC_SF.16 ADC_SF.15 ADC_SF.14
  Top 0.152: ADC_SF.14 ADC_SF.13 ADC_SF.12 | SF_R16.1 31.05,38.05 31,38.1 v31.1,38.1 | SF_C11.1 30.1,33.01 v30.1,34.1 | SF_R15.1 25.62,35.92 25.5,35.8 25.4,35.9 v25.4,36 | SF_C10.1 26.93,39.07 26.9,39.1 v27,39.2 | SF_C17.2 35.6,32.68 v35.6,31.6 | SF_C13.1 36.25,36.1 37.3,36.1 v37.3,36 v37.3,35.99 | SA_C3.2 21.5,63.9 v20.41,63.9 | SA_R3.2 v24.89,63.79 v24.9,63.8 | SA_C4.1 23.49,57.41 23.6,57.3 v23.6,57.4 | H4_PREAMP4.2 20,61.12 v20,60.3 | SA_R10.1 17.55,56.7 v16.1,56.7 | SA_DA.6 18.6,49.3 v18.5,49.4 | SA_C14.1 20.62,39.4 22,39.4 v22.1,39.5 | SA_C15.1 23.91,37.99 24,37.9 v24,38.1 | SA_R17.2 15.88,39.4 v14,39.4 | SA_R18.2 14.16,38 v13.1,38 | SA_C13.1 12.94,35.66 13,35.6 v12.9,35.7 | SA_C17.2 10.88,30.98 v10.8,30.9 | SA_R16.1 7.35,37.25 v7.3,37.3 | SA_C11.1 6.1,32.31 v6.1,33.7 | SA_R15.1 3.5,38.85 v3.5,39.8 | SA_C10.1 5.83,39.87 v5.8,39.9 | SF_PREAMP3.2 44.23,60.73 v44.1,60.6 | PA_R15.1 50.93,35.67 v50.4,36.2 | PF_R15.1 75.23,36.57 v74.6,37.2 | ADC_SF.10 40.76,34.55 v40.9,34.4 | ADC_SF.31 44.76,34.55 v44.7,34.6 | ADC_SF.30 47.05,34.05 v47.1,34.1 | ADC_SF.5 42.53,37.37 v42,37.9 | ADC_SF.23 44.03,30.87 43.6,31.3 v42.7,31.3 | v42.7,31.3 42,31.3 41.53,30.83 ADC_SF.18 | ADC_SF.21 43.03,30.97 v42.7,31.3 | ADC_SF.14 38.74,32.55 v38.5,32.3 | ADC_PA.5 66.83,36.67 v66.3,37.2 | ADC_PA.30 71.16,33.36 v71.3,33.5 | ADC_PA.26 71.24,31.36 v71.3,31.3 | ADC_PA.23 68.33,30.17 68,30.5 67,30.5 | 67,30.5 66.6,30.5 | 66.6,30.5 66,30.5 65.83,30.33 ADC_PA.18 | ADC_PA.21 67.33,30.17 67,30.5 | 66.6,30.5 | 66.6,30.5 v66.6,30.58 | ADC_PA.16 ADC_PA.15 ADC_PA.14 | ADC_PA.14 ADC_PA.13 ADC_PA.12 | ADC_PA.14 62.96,31.86 v62.8,31.7 | ADC_PA.10 65.04,33.86 v65.2,33.7
  Top 0.152: ADC_PF.31 93.22,34.08 v93.2,34.1 | ADC_PF.30 95.53,33.58 v95.6,33.5 | ADC_PF.26 95.53,31.57 v95.6,31.5 | ADC_PF.16 ADC_PF.15 ADC_PF.14 | ADC_PF.14 ADC_PF.13 ADC_PF.12 | ADC_PF.14 87.17,32.08 v87,31.9 | ADC_PF.10 89.03,34.08 v89.3,33.8 | ADC_PF.5 91.03,36.97 v90.8,37.2 | ADC_PF.23 92.53,30.47 92.3,30.7 92.2,30.8 v91.1,30.8 | ADC_PF.18 90.03,30.33 90.5,30.8 v91.1,30.8 | ADC_PF.21 91.53,30.37 v91.1,30.8 | ADC_SA.10 14.2,34.53 v13.98,34.32 | ADC_SA.16 ADC_SA.15 ADC_SA.14 | ADC_SA.14 ADC_SA.13 ADC_SA.12 | ADC_SA.14 14.33,32.53 v14,32.2 | ADC_SA.5 18.03,37.27 v17.8,37.5 | ADC_SA.31 20.33,34.53 v20.2,34.4 | ADC_SA.30 22.47,34.03 v22.6,33.9 | ADC_SA.26 22.47,32.03 v22.6,31.9 | ADC_SA.23 19.53,30.77 19,31.3 18.99,31.29 v18.33,31.29 | ADC_SA.18 17.03,30.66 17.67,31.3 18,31.3 18.01,31.29 v18.33,31.29 | ADC_SA.21 18.53,30.77 18.33,30.97 v18.33,31.29 | v80.2,35.7 80.24,35.66 81.4,35.66 | 81.4,35.66 PF_REFGEN.8 | PF_REFGEN.7 81.49,35.57 81.4,35.66 | ADC_PA.31 69.04,33.86 v69,33.9 | ADC_SF.26 47.05,32.05 v47.1,32.1
  Bottom 0.152: SA_C19.2 44.02,34.6 v44.7,34.6 | SA_C16.2 43.05,31.3 v42.7,31.3 | v66.6,30.58 67.41,29.77 PA_C16.2 | PF_C19.2 92.5,34.1 v93.2,34.1 | PF_C16.2 91.52,30.38 v91.1,30.8 | v20.2,34.4 19.98,34.17 SF_C19.2 | v18.33,31.29 18.48,31.29 SF_C16.2 | PA_C19.2 68.29,33.9 v69,33.9
  pour GND: 0,80 100,80 100,0 0,0
N$1
  Top 0.152: PA_C5.2 69.62,48.25 69,48.25 PA_DA.5 68.8,47.25 PA_R8.1
N$2
  Top 0.152: PA_C7.1 67.6,51.45 PA_R7.2 69.1,50.3 PA_DA.8 68.85,49.95 PA_C5.1
N$3
  Top 0.152: PA_C7.2 64.15,51.4 PA_R11.2 64.4,51.15 PA_DA.1 64.35,49.95 PA_C9.1
N$4
  Top 0.152: PA_R6.2 67.5,53.15 PA_C6.1 69.05,53.1 PA_R7.1 PA_R5.1
N$5
  Top 0.152: PA_R10.2 65.7,53.15 PA_C6.2 64.15,53.1 PA_R11.1 PA_R14.1
N$6
  Top 0.152: PA_R12.1 64.4,47.95 PA_DA.4 62.7,48.05 PA_C9.2
N$7
  Top 0.152: PA_R9.1 PA_R8.2 69.25,44.85 71.8,47.4 71.8,50.35 PA_R5.2
N$8
  Top 0.152: PA_R13.1 65.8,44.8 | 65.8,44.8 PA_R12.2 | PA_R14.2 61.4,50.35 61.4,47.7 64.3,44.8 65.8,44.8
N$9
  Top 0.152: SF_C5.2 44.6,48.75 SF_DA.5 43.6,47.75 SF_R8.1
N$10
  Top 0.152: SF_C5.1 45.95,50.6 SF_DA.8 44.7,50.8 SF_R7.2 43.4,51.95 SF_C7.1
N$11
  Top 0.152: SF_C9.1 38.65,50.6 SF_DA.1 40.2,50.7 SF_R11.2 41.6,51.95 SF_C7.2
N$12
  Top 0.152: SF_R5.1 SF_R7.1 44.65,53.6 43.5,53.6 | SF_C6.1 43.5,53.6 | SF_R6.2 43.3,53.8 43.5,53.6
N$13
  Top 0.152: SF_R14.1 SF_R11.1 41.6,53.65 SF_C6.2 41.7,53.65 SF_R10.2
N$14
  Top 0.152: SF_R12.1 SF_DA.4 SF_C9.2
N$15
  Top 0.152: SF_R9.1 SF_R8.2 45.15,45.65 47.2,47.7 47.2,51.15 SF_R5.2
N$16
  Top 0.152: SF_R13.1 SF_R12.2 39.25,45.65 37.1,47.8 37.1,50.95 SF_R14.2
N$17
  Top 0.152: SA_R8.1 20,48.65 SA_DA.5 21.7,48.65 SA_C5.2
N$18
  Top 0.152: SA_C7.1 20.45,51.8 SA_R7.2 20.5,50.8 SA_DA.8 21.65,50.6 SA_C5.1
N$19
  Top 0.152: SA_C7.2 17.4,51.75 SA_R11.2 SA_DA.1 14.35,50.6 SA_C9.1
N$20
  Top 0.152: SA_R7.1 20.6,53.55 | 20.6,53.55 SA_R5.1 | 20.6,53.55 20.45,53.4 SA_C6.1 19.1,53.45 SA_R6.2
N$21
  Top 0.152: SA_R14.1 SA_R11.1 17.4,53.45 SA_C6.2 17.6,53.55 SA_R10.2
N$22
  Top 0.152: SA_C9.2 14.3,48.65 SA_DA.4 16.8,47.75 SA_R12.1
N$23
  Top 0.152: SA_R9.1 18.8,45.6 SA_R8.2 20.95,45.75 22.9,47.7 22.9,51.25 SA_R5.2
N$24
  Top 0.152: SA_R12.2 16.8,45.7 | 16.8,45.7 SA_R13.1 | SA_R14.2 13.1,50.85 13.1,47.9 15.3,45.7 16.8,45.7
N$88
  Top 0.152: PF_R13.1 88.42,43.23 88.42,45.2 PF_R12.2 86.45,45.35 84.1,47.7 84.1,50.6 84.79,51.29 PF_R14.2
N$97
  Top 0.152: PF_R8.1 90.33,47.08 PF_DA.5 92.92,48.25 PF_C5.2
N$98
  Top 0.152: PF_C5.1 92.86,50.2 91.7,50.2 | 91.7,50.2 PF_DA.8 | 91.7,50.2 91.7,51.31 PF_R7.2 PF_C7.1
N$99
  Top 0.152: PF_C7.2 88.7,51.41 PF_R11.2 86.91,50.4 PF_DA.1 85.37,50.2 PF_C9.1
N$100
  Top 0.152: PF_C6.1 90.6,53 | 90.6,53 91.69,53 PF_R7.1 93.84,53.09 PF_R5.1 | PF_R6.2 90.6,54.34 90.6,53
N$101
  Top 0.152: 88.61,53.11 PF_R11.1 PF_R14.1 | 88.61,53.11 PF_C6.2 | PF_R10.2 88.61,54.5 88.61,53.11
N$102
  Top 0.152: PF_R12.1 87.22,48.25 PF_DA.4 85.5,48.25 PF_C9.2
N$103
  Top 0.152: PF_REFGEN.4 PF_C11.2
N$104
  Top 0.152: PF_R15.2 77.03,34.41 PF_REFGEN.3
N$105
  Top 0.152: PF_R16.2 83.33,37.09 PF_C12.1
N$109
  Top 0.152: PF_R9.1 90.33,43.21 90.33,45 PF_R8.2 91.67,45.27 93.87,47.47 PF_R5.2
N$110
  Top 0.152: PA_REFGEN.4 52.89,32.05 PA_C11.2
N$116
  Top 0.152: PA_REFGEN.3 51.57,34.06 PA_R15.2
N$117
  Top 0.152: PA_C12.1 58.91,37.12 PA_R16.2
N$118
  Top 0.152: SF_REFGEN.4 SF_C11.2
N$121
  Top 0.152: SF_REFGEN.3 28.19,34.57 27.57,34.57 27.22,34.22 SF_R15.2
N$124
  Top 0.152: SF_R16.2 33.98,36.31 SF_C12.1
N$129
  Top 0.152: SA_REFGEN.4 SA_C11.2
N$130
  Top 0.152: SA_REFGEN.3 3.33,34.47 2.9,34.9 2.9,36.4 3.52,37.02 SA_R15.2
N$131
  Top 0.152: SA_R16.2 10.08,35.59 SA_C12.1
N$132
  Top 0.152: ADC_PF.2 92.53,37.03 92.91,37.41 PF_C14.2
N$133
  Top 0.152: PF_R1.1 89.53,65.09 PF_C2.2
N$134
  Top 0.152: PF_R2.1 89.71,59.21 PF_C1.1 | PF_R1.2 89.53,59.43 PF_C1.1 | PF_C1.1 90.92,59.23 PF_PREAMP.3
N$135
  Top 0.152: PF_PREAMP.1 92.4,59.26 PF_C3.1 93.34,59.27 PF_R3.1 PF_R4.1
N$136
  Top 0.152: PA_C15.2 70.91,36.1 69.22,36.1 ADC_PA.1
N$137
  Top 0.152: PA_C2.2 67.53,65.55 PA_R1.1
N$138
  Top 0.152: PA_R2.1 66.01,61.65 PA_C1.1 67.52,61.67 PA_PREAMP.3 67.58,63.7 PA_R1.2
N$139
  Top 0.152: PA_PREAMP.1 69.25,61.61 PA_C3.1 71.71,62.3 PA_R3.1 PA_R4.1
N$140
  Top 0.152: ADC_PA.8 62.9,35.71 PA_R18.1
N$141
  Top 0.152: SF_C2.2 SF_R1.1
N$142
  Top 0.152: SF_R2.1 40.25,61.41 SF_C1.1 42.61,61.41 42.65,61.45 SF_PREAMP3.3 43.63,61.5 SF_R1.2
N$143
  Top 0.152: SF_PREAMP3.1 45.25,61.45 SF_C3.1 46.04,62.25 SF_R3.1 48.03,62.15 SF_R4.1
N$144
  Top 0.152: ADC_PA.7 65.83,36.57 65.5,36.9 65.11,36.9 PA_R17.1
N$145
  Top 0.152: SA_R1.1 16.51,64.33 SA_C2.2
N$146
  Top 0.152: SA_R2.1 17.81,61.13 SA_C1.1 19.24,61.15 H4_PREAMP4.3 19.28,62.58 SA_R1.2
N$147
  Top 0.152: H4_PREAMP4.1 21.53,62.14 SA_C3.1 23.34,62.17 SA_R3.1 23.53,62.19 SA_R4.1
N$148
  Top 0.152: ADC_PA.11 62.06,33.36 PA_C17.1
N$149
  Top 0.152: ADC_PA.25 70.63,30.44 PA_C18.2
N$150
  Top 0.152: ADC_PF.1 95.23,35.92 PF_C15.2
N$151
  Top 0.152: PA_C14.2 68.68,36.91 68.33,36.56 ADC_PA.2
N$152
  Top 0.152: ADC_PF.8 87.58,35.92 PF_R18.1
N$153
  Top 0.152: PF_R17.1 89.61,37.29 90.03,36.87 ADC_PF.7
N$154
  Top 0.152: ADC_PF.11 86.36,33.58 PF_C17.1
N$155
  Top 0.152: PF_C18.2 94.91,30.69 94.52,31.07 ADC_PF.25
N$156
  Top 0.152: ADC_SF.1 44.94,36.8 SF_C15.2
N$157
  Top 0.152: ADC_SF.8 40.66,36.76 SF_R18.1
N$158
  Top 0.152: SF_R17.1 40.82,38.28 41.53,37.57 ADC_SF.7
N$159
  Top 0.152: ADC_SF.11 38.67,34.05 SF_C17.1
N$160
  Top 0.152: SF_C18.2 46.53,31.02 46,31.55 ADC_SF.25
N$161
  Top 0.152: ADC_SF.2 44.03,37.24 SF_C14.2
N$162
  Top 0.152: ADC_SA.1 22.34,36.38 SA_C15.2
N$163
  Top 0.152: ADC_SA.8 14.24,36.38 SA_R18.1
N$164
  Top 0.152: SA_R17.1 16.65,37.85 17.03,37.47 ADC_SA.7
N$165
  Top 0.152: ADC_SA.11 14.47,34.03 SA_C17.1
N$166
  Top 0.152: SA_C18.2 21.83,31.08 ADC_SA.25
N$167
  Top 0.152: ADC_SA.2 19.53,37.43 19.91,37.81 SA_C14.2
RAW_PA
  Top 0.152: PA_IN.1 67.37,68.89 PA_C2.1
RAW_PF
  Top 0.152: PF_IN.1 88.27,72.4 89.33,71.34 PF_C2.1
RAW_SA
  Top 0.152: SA_IN.1 16.52,71.78 16.13,71.39 SA_C2.1
RAW_SF
  Top 0.152: SF_IN.1 43.87,68.41 SF_C2.1
REF_PA
  Top 0.152: PA_REFGEN.6 PA_REFGEN.5 58.8,33.41 PA_C12.2 PA_C13.2 61,34.3 61.07,34.36 ADC_PA.9
REF_PF
  Top 0.152: 83.35,34.18 PF_C13.2 85.43,34.58 | 83.35,34.18 PF_C12.2 82.88,33.71 PF_REFGEN.5 | 85.43,34.58 85.5,34.58 | 85.5,34.58 ADC_PF.9 | PF_REFGEN.6 83.17,34.36 83.35,34.18 | 85.43,34.58 85.5,34.58
REF_SA
  Top 0.152: SA_REFGEN.6 SA_REFGEN.5 10,33.82 SA_C12.2 10.15,33.96 SA_C13.2 12.83,33.96 13.9,35.03 ADC_SA.9
REF_SF
  Top 0.152: SF_REFGEN.6 SF_REFGEN.5 34.18,34.11 SF_C12.2 36.11,34.26 SF_C13.2 36.89,35.05 ADC_SF.9
SCLK  (via drill 0.35)
  Top 0.152: ADC_SF.22 43.53,18.13 v43.5,18.1 | ADC_PA.22 67.83,18.13 v67.8,18.1 | ADC_PF.22 92.03,18.17 v92.1,18.1 | ADC_SA.22 19.03,18.37 v19.5,17.9
  Bottom 0.152: FPGA_CON1.9 18.94,9.94 18.94,17.34 v19.5,17.9 19.6,18 19.7,18.1 v43.5,18.1 43.8,18.1 v67.8,18.1 68.3,18.1 76.8,18.1 v92.1,18.1
START  (via drill 0.35)
  Top 0.152: ADC_SF.17 41.03,16.63 v41,16.6 | ADC_PA.17 65.33,16.63 v65.3,16.6 | ADC_PF.17 89.53,16.63 v89.5,16.6 | ADC_SA.17 16.53,17.47 18.8,15.2 v19.99,15.2 v20,15.21
  Bottom 0.152: FPGA_CON1.12 v20,15.21 20,16 20.6,16.6 39.8,16.6 v41,16.6 64.3,16.6 v65.3,16.6 v89.5,16.6

### Text on the board
tPlace: SA | SF | PA | PF | The Underwater Robotics Team / Center for Automotive Research | Acoustics Board